# EAGLE board ENERGIS_Rack-PDU_1.0.0 (EAGLE 9.2.1), part 1 of 3
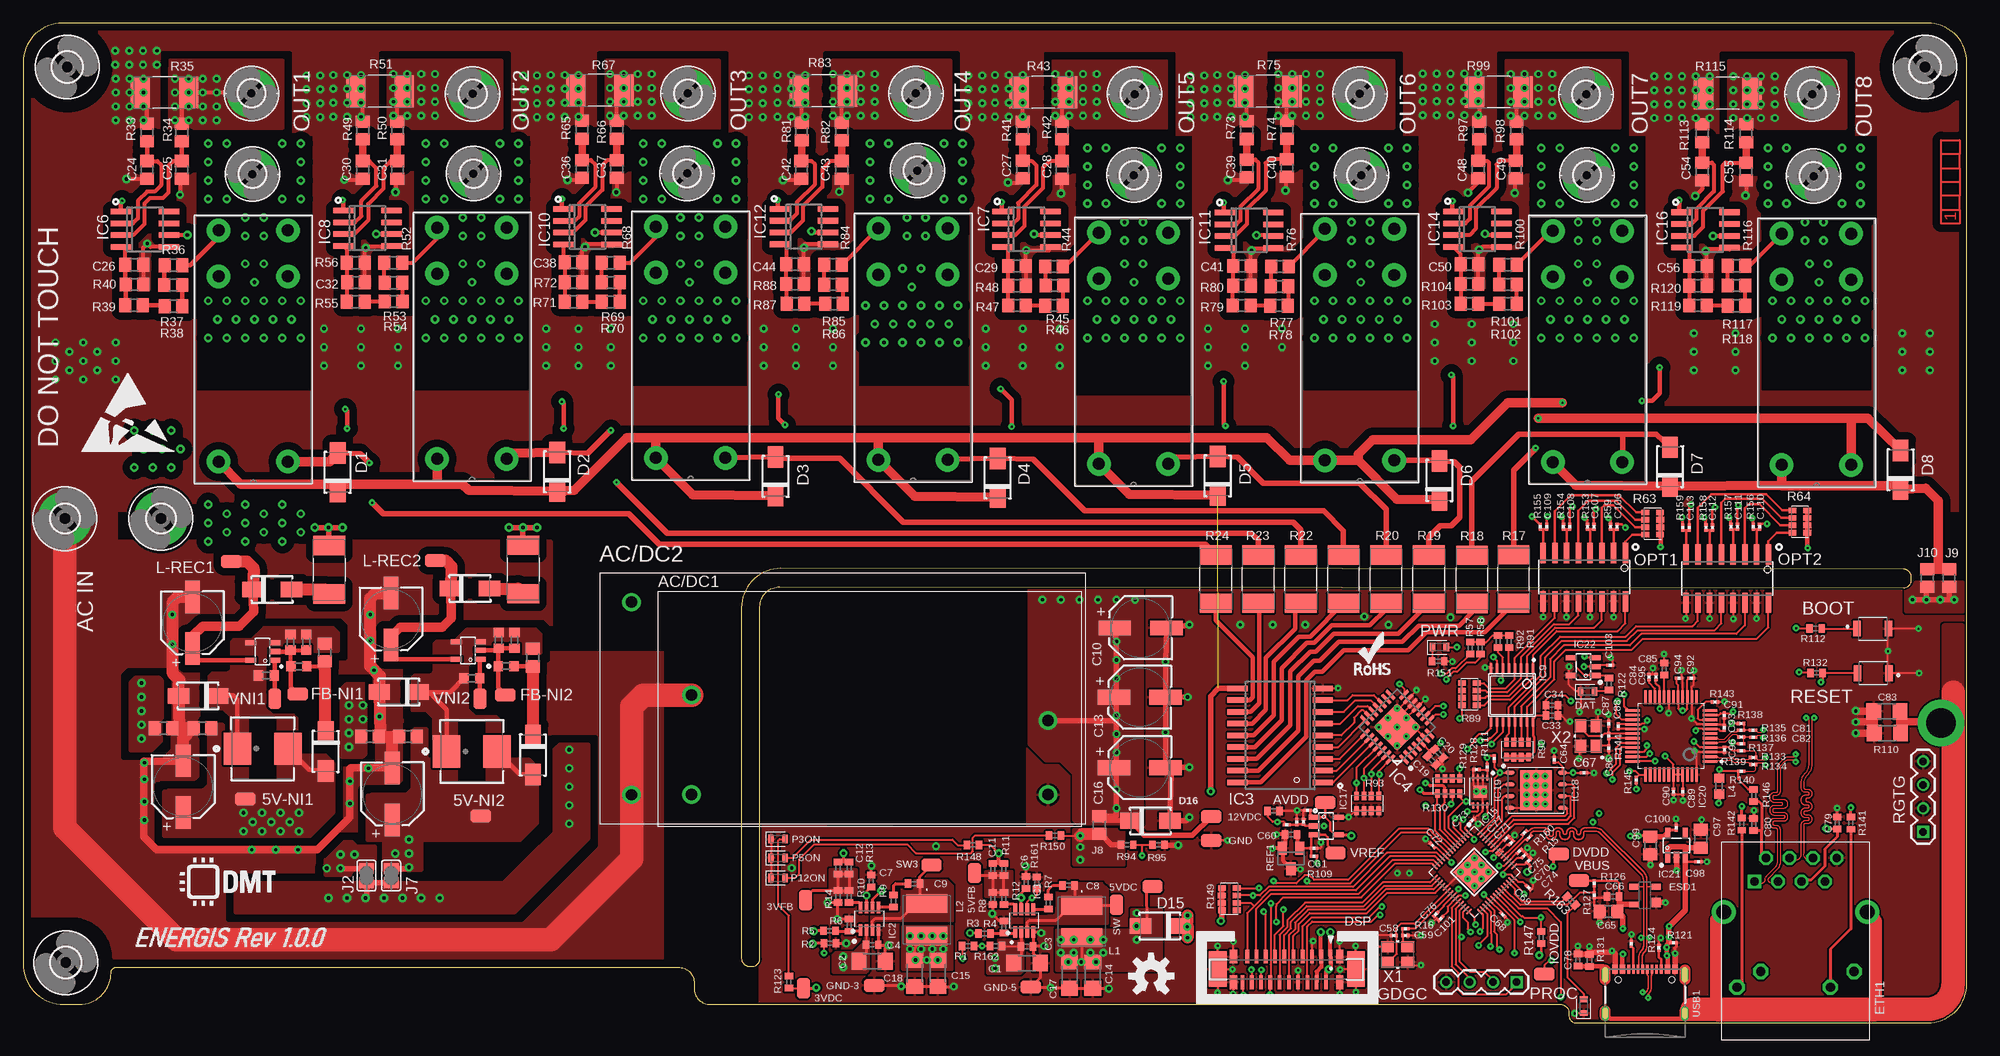
[diagram p8: board, top side]
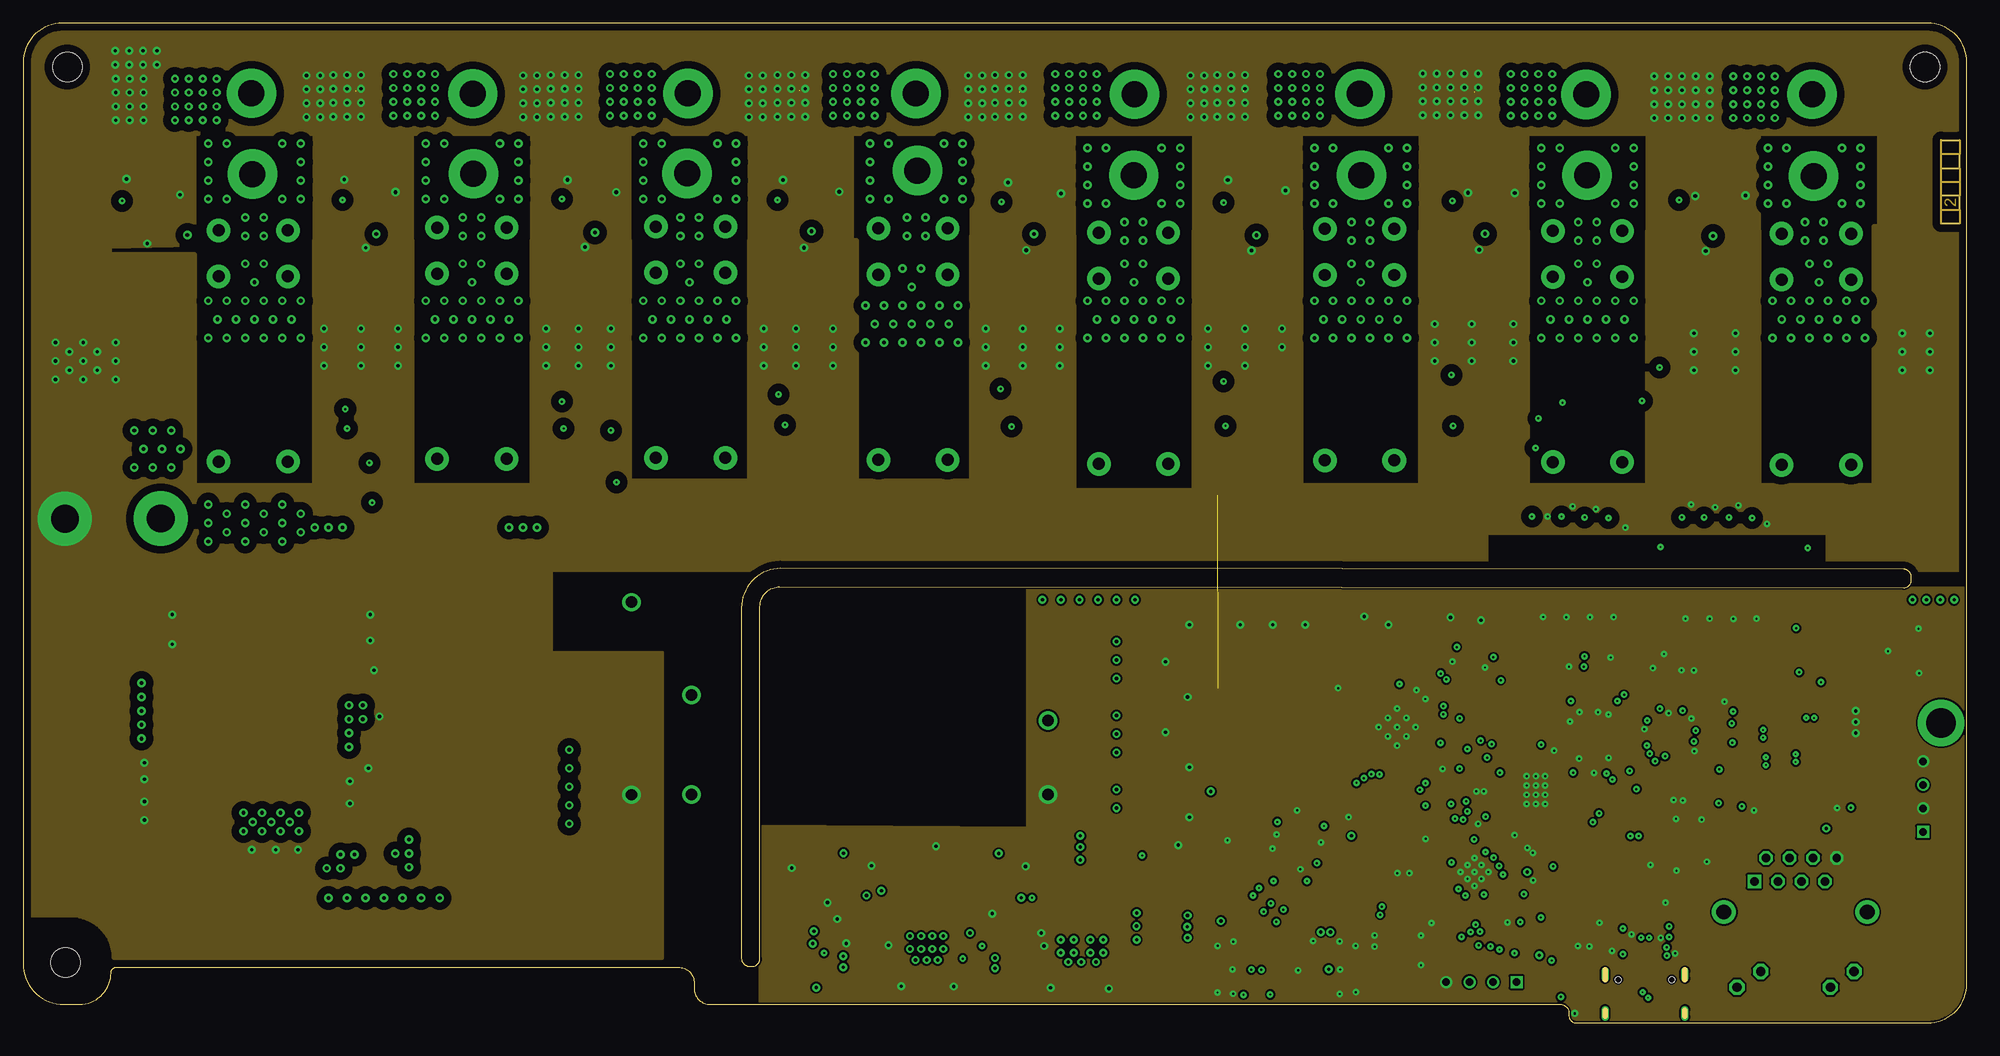
[diagram p9: board, inner layer GND/AGND]
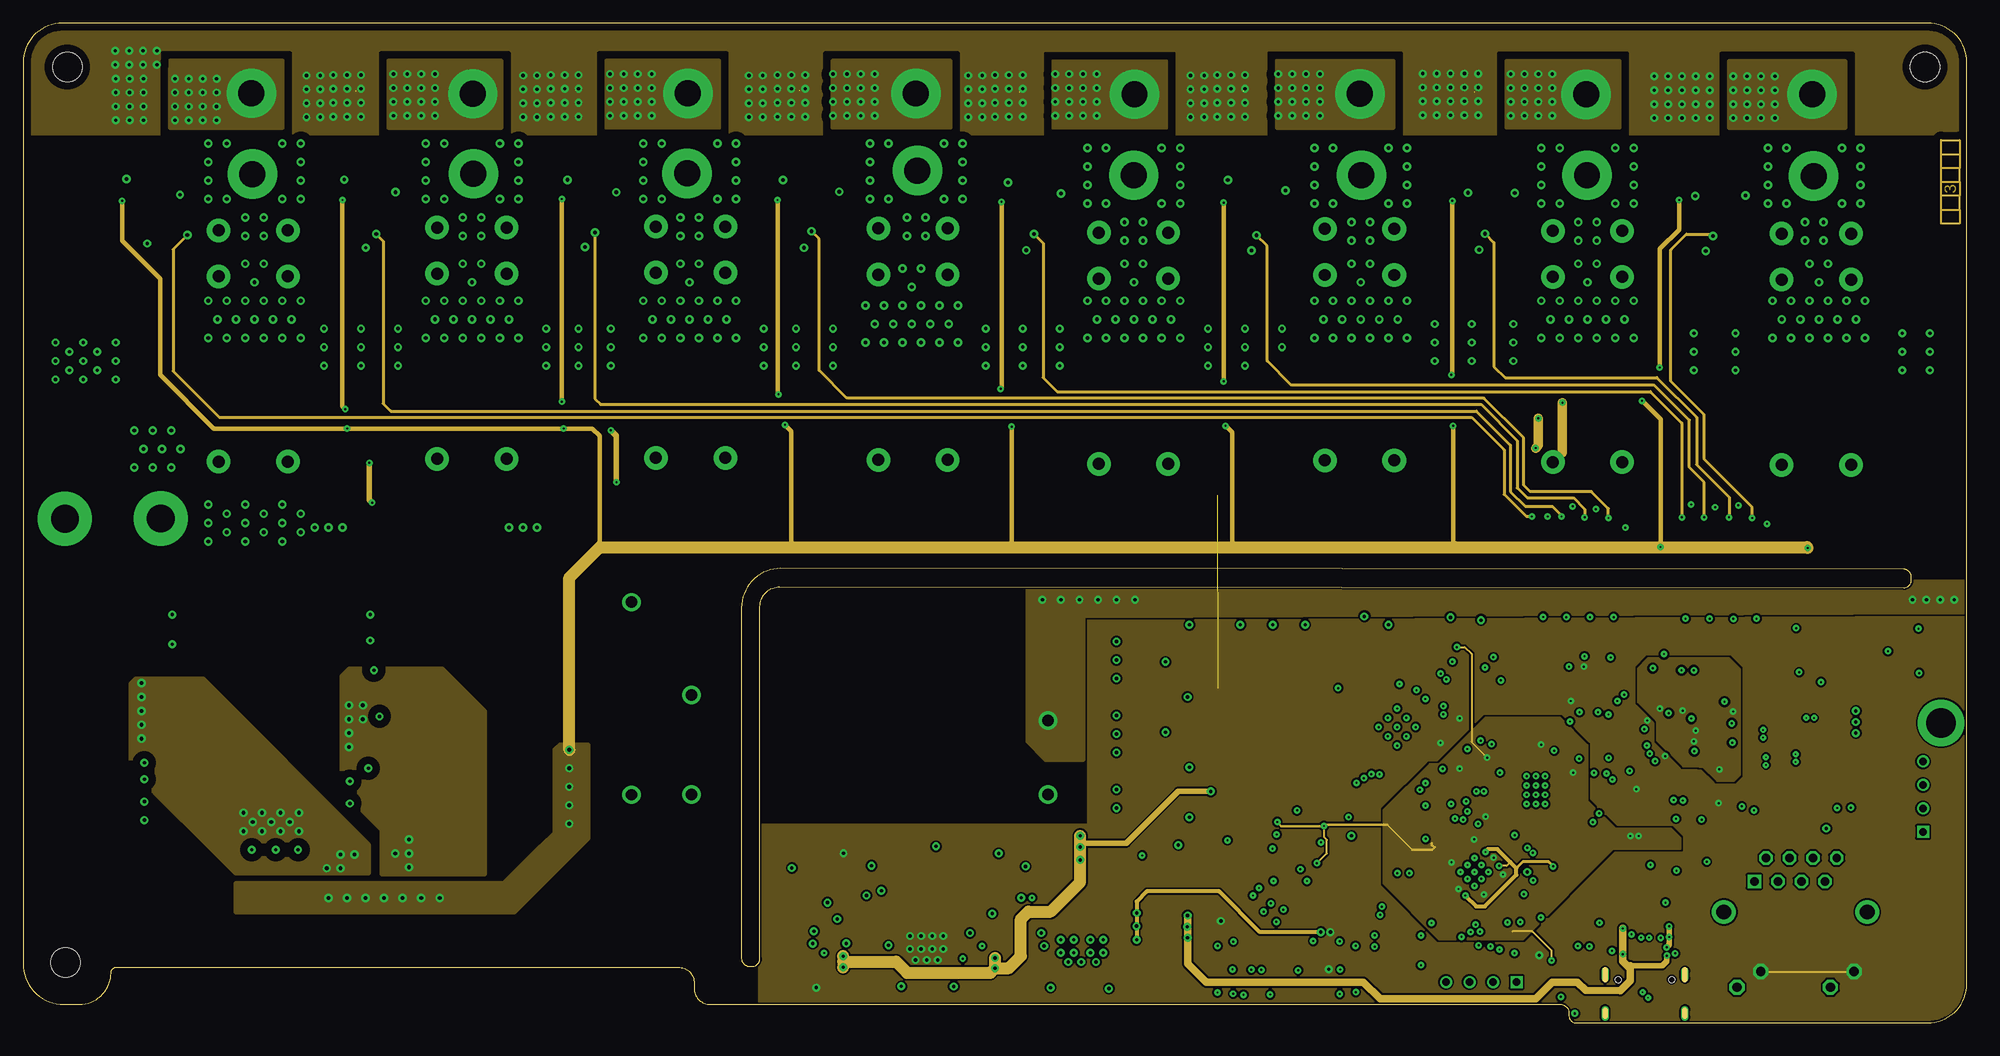
[diagram p10: board, inner layer PWR-3/SIG]
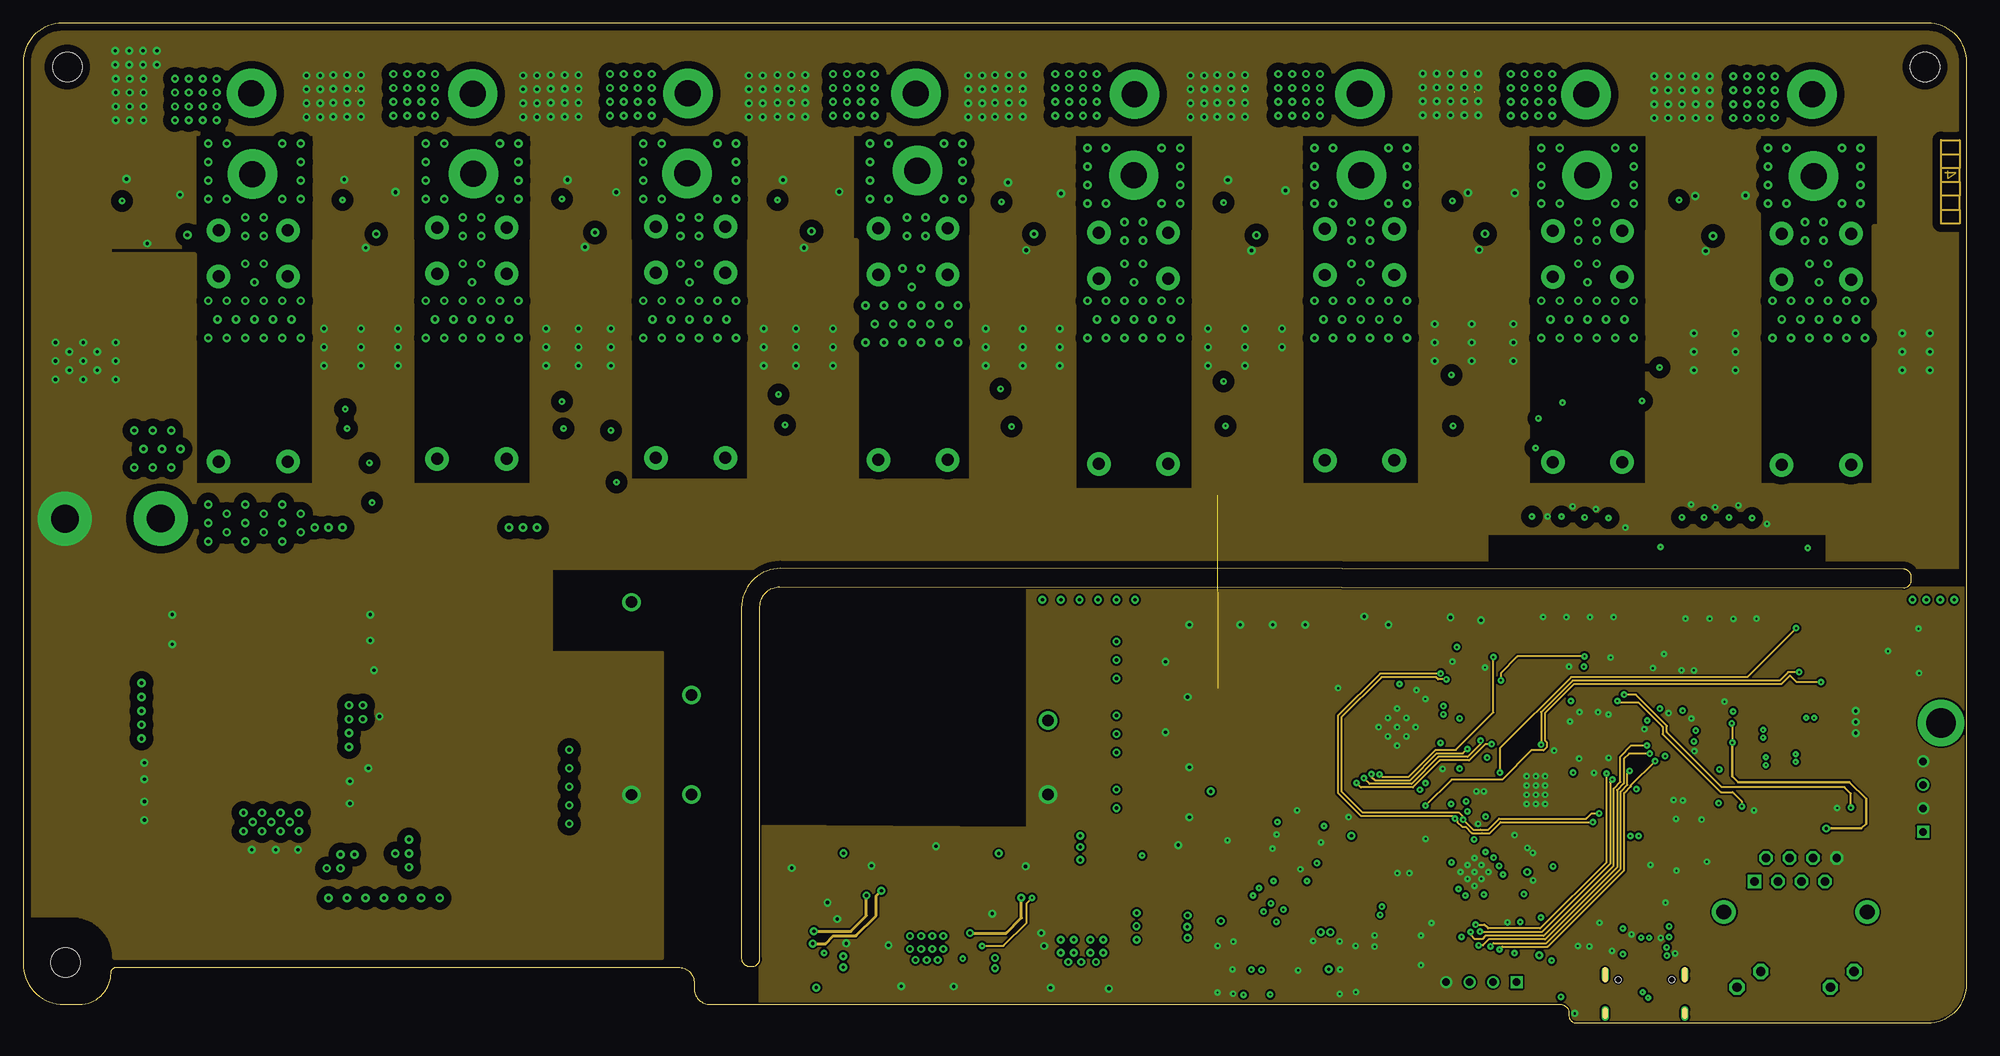
[diagram p11: board, inner layer SIG/AGND]
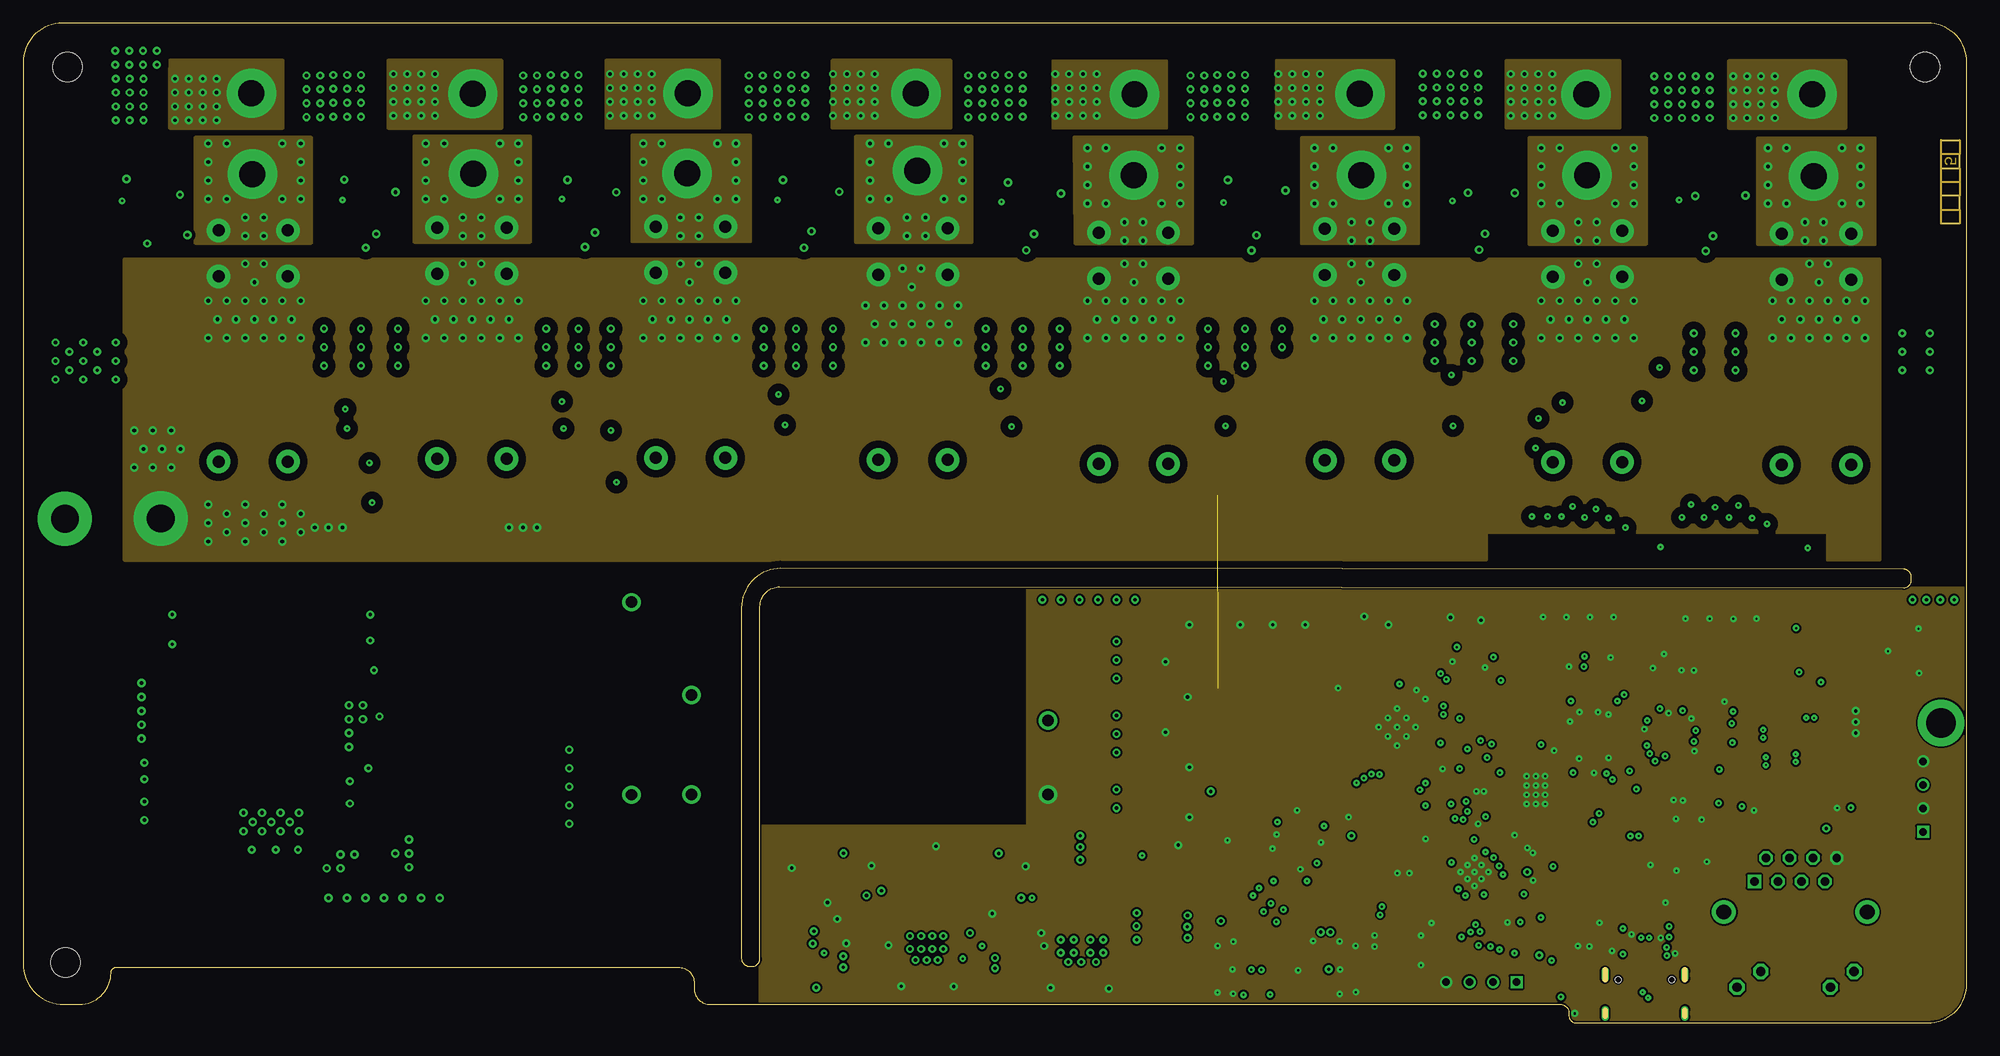
[diagram p12: board, inner layer GND-2/AC_L]
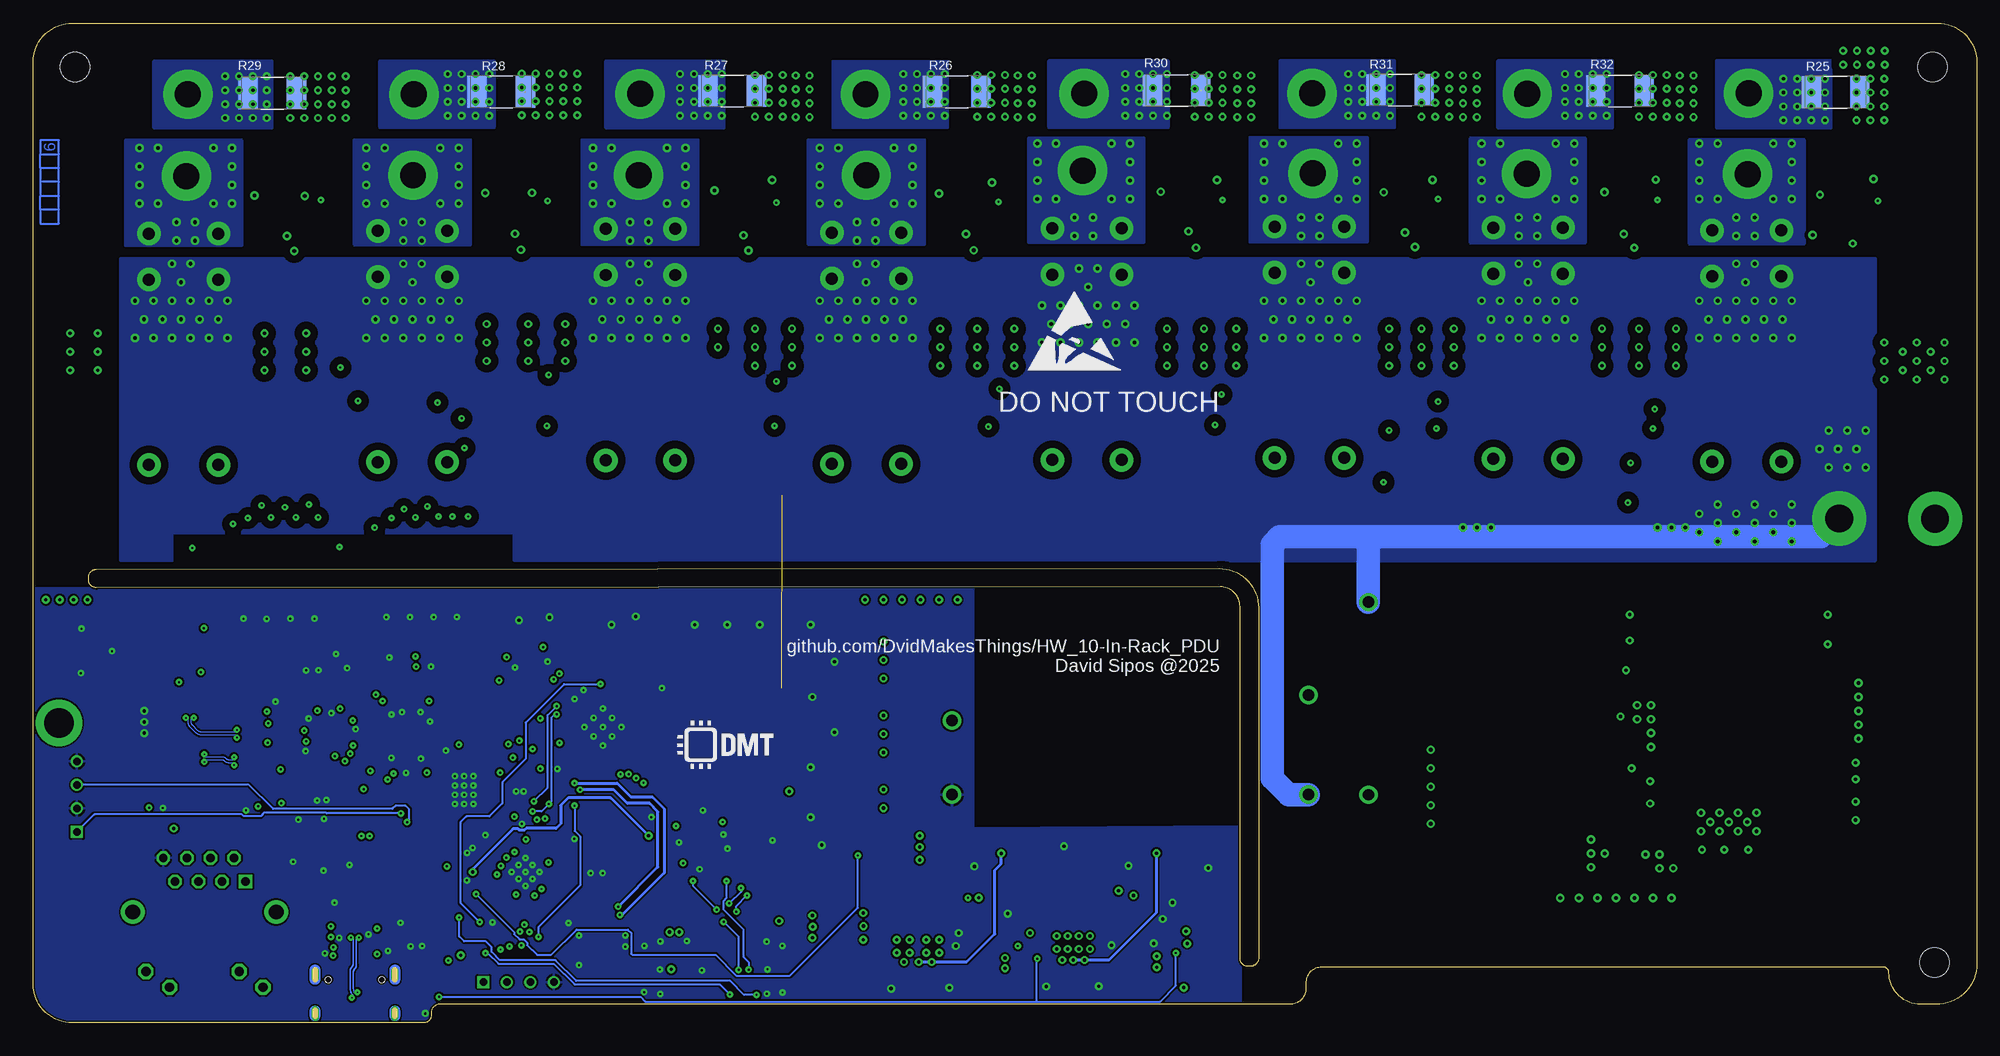
[diagram p13: board, bottom side, seen from below]

Size 210 x 108 mm. Coordinates in mm from the lower left corner, seen from the top.
Outline: 210,4.23 210,103.77 arc90 205.77,108 4.23,108 arc90 0,103.77 0,6.39 arc90 4.39,2 6.08,2 arc90 9.5,5.42 arc-90 10.08,6 70.79,6 arc-90 72.5,4.29 72.5,3.71 arc90 74.21,2 166.06,2 arc-90 167,1.06 167,0.77 arc90 167.77,0 205.77,0 arc90 210,4.23
Outline: 81.73,47.1 203.15,47 arc90 204,47.85 204,48.15 arc90 203.15,49 81.86,49.1 arc90 77.6,44.84 77.6,7 arc90 78.5,6.1 78.78,6.1 arc90 79.6,6.92 79.6,44.97 arc-90 81.73,47.1
Copper layers (1+2*3+14*15+16): SIG_HS/SIG 0.035mm / dielectric 0.0994mm / GND/AGND 0.0152mm / dielectric 0.55mm / PWR-3/SIG 0.0152mm / dielectric 0.1088mm / SIG/AGND 0.0152mm / dielectric 0.55mm / GND-2/AC_L 0.0152mm / dielectric 0.0994mm / SIG_BTM/AC_L 0.035mm
Design rules "JLC06161H-3313A_6-layer_1.6 mm-Standard": minimum track width 3.5mil, minimum drill 0.15mm, track to track 3.5mil, track to pad 3.5mil, pad to pad 3.5mil, via to via 3.5mil, smd to smd 3.5mil, copper to edge 0.2mm, drill to drill 6mil, minimum pad ring 8mil, minimum via ring 0.25mm, stop-mask expansion 0.05mm, vias tented up to drill 16mil, thermal gap 10mil
Net classes: 0 50R_SE: width 0.2 mm, drill 0.2 mm, clearance 0.178 mm; 1 100R_DIFFPAIR: width 0.121 mm, drill 0.15 mm, clearance 0.191 mm; 2 90R_DIFFPAIR: width 0.155 mm, drill 0.15 mm, clearance 0.191 mm; 3 AC_MEA: width 0.406 mm, drill 0.35 mm, clearance 0.203 mm; 4 AC_SIG: width 0.305 mm, drill 0.2 mm, clearance 0.35 mm

## Footprints (pad centres in the part's own frame; a part is rotated, then mirrored left to right if it is on the bottom)
TP = smd 2.2 x 1.4: TP 0,0
IRM_10_12 = drill 1.24: +V 19.25,0.02; -V 19.25,-7.98; AC_L -19.25,-7.98; AC_N -19.25,2.77
IRM_15_12 = drill 1.24: +V 23.47,-2.4; -V 23.47,-10.4; AC/L -21.53,10.4; AC/N -21.53,-10.4
3,0-PAD = drill 3 pad 5.842: B3,0 0,0
B3U-1000P = smd 0.8 x 1.7: 1 -1.7,0; 2 1.7,0
1206 = smd 1.6 x 1.803: 1 -1.422,0; 2 1.422,0
0402 = smd 0.7 x 0.9: 1 -0.65,0; 2 0.65,0
0603 = smd 1 x 1.1: 1 -0.85,0; 2 0.85,0
6.3X7.7(DXL) = smd 3.5 x 1.6: 1 2.8,0; 2 -2.8,0
0805 = smd 1.3 x 1.5: 1 -0.95,0; 2 0.95,0
0201 = smd 0.34 x 0.35: 1 -0.275,0; 2 0.275,0
C1206 = smd 1.6 x 1.803: 1 -1.422,0; 2 1.422,0
SMA/DO-214AC = smd 2.3 x 1.7: A 2.1,0; C -2.1,0
LED-0603 = smd 0.612 x 0.912: A 0.75,0; C -0.75,0
FPC20 = smd 0.4 x 1.5: 1 -4.552,-1.362; 2 -4.052,1.438; 3 -3.552,-1.362; 4 -3.052,1.438; 5 -2.552,-1.362; 6 -2.052,1.438; 7 -1.552,-1.362; 8 -1.052,1.438; 9 -0.552,-1.362; 10 -0.052,1.438; 11 0.448,-1.362; 12 0.948,1.438; 13 1.448,-1.362; 14 1.948,1.438; 15 2.448,-1.362; 16 2.948,1.438; 17 3.448,-1.362; 18 3.948,1.438; 19 4.448,-1.362; 20 4.948,1.438 | smd 1.93 x 3.81: Z0 -7.303,0; Z5 7.62,0 | smd 0.8 x 1.5: Z1 -5.552,-1.362; Z2 -5.552,1.438; Z3 5.948,-1.362; Z4 5.948,1.438
SOT143 = smd 1 x 1: 1 -0.75,-1.2 | smd 0.6 x 1: 2 0.95,-1.2; 3 0.95,1.2; 4 -0.95,1.2
J1B1211CCD = drill 0.9 square: 1 -4.445,6.35 | drill 0.9 octagon: 2 -3.175,8.89; 3 -1.905,6.35; 4 -0.635,8.89; 5 0.635,6.35; 6 1.905,8.89; 7 3.175,6.35; 8 4.445,8.89 | drill 1.02 octagon: 9 -6.325,-5.08; 10 -3.758,-3.38; 11 3.758,-5.08; 12 6.325,-3.38 | drill 1.6: 13 -7.75,3.05; 14 7.75,3.05
1X4 = drill 0.8 square: 1 0,3.81 | drill 0.8: 2 0,1.27; 3 0,-1.27; 4 0,-3.81
SOT65P280X110-8N = smd 1.259 x 0.4: 1 -1.228,0.975; 2 -1.228,0.325; 3 -1.228,-0.325; 4 -1.228,-0.975; 5 1.228,-0.975; 6 1.228,-0.325; 7 1.228,0.325; 8 1.228,0.975
SO18 = smd 0.6 x 2.2: 1 -5.08,-4.6; 2 -3.81,-4.6; 3 -2.54,-4.6; 4 -1.27,-4.6; 5 0,-4.6; 6 1.27,-4.6; 7 2.54,-4.6; 8 3.81,-4.6; 9 5.08,-4.6; 10 5.08,4.6; 11 3.81,4.6; 12 2.54,4.6; 13 1.27,4.6; 14 0,4.6; 15 -1.27,4.6; 16 -2.54,4.6; 17 -3.81,4.6; 18 -5.08,4.6
QFN28[6X6]ML = smd 1.27 x 0.35: 1 -2.985,1.95; 2 -2.985,1.3; 3 -2.985,0.65; 4 -2.985,0; 5 -2.985,-0.65; 6 -2.985,-1.3; 7 -2.985,-1.95; 15 2.985,-1.95; 16 2.985,-1.3; 17 2.985,-0.65; 18 2.985,0; 19 2.985,0.65; 20 2.985,1.3; 21 2.985,1.95 | smd 0.35 x 1.27: 8 -1.95,-2.985; 9 -1.3,-2.985; 10 -0.65,-2.985; 11 0,-2.985; 12 0.65,-2.985; 13 1.3,-2.985; 14 1.95,-2.985; 22 1.95,2.985; 23 1.3,2.985; 24 0.65,2.985; 25 0,2.985; 26 -0.65,2.985; 27 -1.3,2.985; 28 -1.95,2.985 | smd 3.7 x 3.7: PAD 0,0
SOT23-5 = smd 0.55 x 1.2: 1 -0.95,-1.3; 2 0,-1.3; 3 0.95,-1.3; 4 0.95,1.3; 5 -0.95,1.3
SO8 = smd 0.6 x 2.2: 1 -1.905,-2.6; 2 -0.635,-2.6; 3 0.635,-2.6; 4 1.905,-2.6; 5 1.905,2.6; 6 0.635,2.6; 7 -0.635,2.6; 8 -1.905,2.6
TSSOP16 = smd 0.305 x 0.991: 1 -2.275,-2.918; 2 -1.625,-2.918; 3 -0.975,-2.918; 4 -0.325,-2.918; 5 0.325,-2.918; 6 0.975,-2.918; 7 1.625,-2.918; 8 2.275,-2.918; 9 2.275,2.918; 10 1.625,2.918; 11 0.975,2.918; 12 0.325,2.918; 13 -0.325,2.918; 14 -0.975,2.918; 15 -1.625,2.918; 16 -2.275,2.918
QFN56 = smd 0.837 x 0.22: 1 -3.437,2.6; 2 -3.437,2.2; 3 -3.437,1.8; 4 -3.437,1.4; 5 -3.437,1; 6 -3.437,0.6; 7 -3.437,0.2; 8 -3.437,-0.2; 9 -3.437,-0.6; 10 -3.437,-1; 11 -3.437,-1.4; 12 -3.437,-1.8; 13 -3.437,-2.2; 14 -3.437,-2.6; 29 3.437,-2.6; 30 3.437,-2.2; 31 3.437,-1.8; 32 3.437,-1.4; 33 3.437,-1; 34 3.437,-0.6; 35 3.437,-0.2; 36 3.437,0.2; 37 3.437,0.6; 38 3.437,1; 39 3.437,1.4; 40 3.437,1.8; 41 3.437,2.2; 42 3.437,2.6 | smd 0.22 x 0.837: 15 -2.6,-3.437; 16 -2.2,-3.437; 17 -1.8,-3.437; 18 -1.4,-3.437; 19 -1,-3.437; 20 -0.6,-3.437; 21 -0.2,-3.437; 22 0.2,-3.437; 23 0.6,-3.437; 24 1,-3.437; 25 1.4,-3.437; 26 1.8,-3.437; 27 2.2,-3.437; 28 2.6,-3.437; 43 2.6,3.437; 44 2.2,3.437; 45 1.8,3.437; 46 1.4,3.437; 47 1,3.437; 48 0.6,3.437; 49 0.2,3.437; 50 -0.2,3.437; 51 -0.6,3.437; 52 -1,3.437; 53 -1.4,3.437; 54 -1.8,3.437; 55 -2.2,3.437; 56 -2.6,3.437 | smd 3.2 x 3.2: PAD 0,0
SON127P600X500X75-8N = smd 1.012 x 0.432: 1 -2.85,1.905; 2 -2.85,0.635; 3 -2.85,-0.635; 4 -2.85,-1.905; 5 2.85,-1.905; 6 2.85,-0.635; 7 2.85,0.635; 8 2.85,1.905 | smd 3.4 x 4.3: PAD 0,0
SON50P300X200X50-9T130X140N = smd 0.711 x 0.27: 1 -1.501,0.75; 2 -1.501,0.25; 3 -1.501,-0.25; 4 -1.501,-0.75; 5 1.501,-0.75; 6 1.501,-0.25; 7 1.501,0.25; 8 1.501,0.75 | smd 1.3 x 1.4: 9 0,0
LQFP48 = smd 1.56 x 0.28: 1 -4.18,2.75; 2 -4.18,2.25; 3 -4.18,1.75; 4 -4.18,1.25; 5 -4.18,0.75; 6 -4.18,0.25; 7 -4.18,-0.25; 8 -4.18,-0.75; 9 -4.18,-1.25; 10 -4.18,-1.75; 11 -4.18,-2.25; 12 -4.18,-2.75; 25 4.18,-2.75; 26 4.18,-2.25; 27 4.18,-1.75; 28 4.18,-1.25; 29 4.18,-0.75; 30 4.18,-0.25; 31 4.18,0.25; 32 4.18,0.75; 33 4.18,1.25; 34 4.18,1.75; 35 4.18,2.25; 36 4.18,2.75 | smd 0.28 x 1.56: 13 -2.75,-4.18; 14 -2.25,-4.18; 15 -1.75,-4.18; 16 -1.25,-4.18; 17 -0.75,-4.18; 18 -0.25,-4.18; 19 0.25,-4.18; 20 0.75,-4.18; 21 1.25,-4.18; 22 1.75,-4.18; 23 2.25,-4.18; 24 2.75,-4.18; 37 2.75,4.18; 38 2.25,4.18; 39 1.75,4.18; 40 1.25,4.18; 41 0.75,4.18; 42 0.25,4.18; 43 -0.25,4.18; 44 -0.75,4.18; 45 -1.25,4.18; 46 -1.75,4.18; 47 -2.25,4.18; 48 -2.75,4.18
SJ = smd 1.168 x 1.6: 1 -0.762,0; 2 0.762,0
RELAY_G2RL-1A-E_DC5_OMR = drill 1.295 pad 2.54: 1 -3.683,12.776; 3 -3.683,-7.239; 4 -3.683,-12.217; 5 3.81,-12.217; 6 3.81,-7.239; 8 3.81,12.776
SRR5228A = smd 4.4 x 2: 1 0,1.75; 2 0,-1.75
L-6.6X6.6 = smd 2.95 x 3.5: 1 -2.725,0; 2 2.725,0
2,8-PAD = drill 2.8 pad 5.334: B2,8 0,0
SO16 = smd 0.61 x 2.21: 1 -4.445,-2.616; 2 -3.175,-2.616; 3 -1.905,-2.616; 4 -0.635,-2.616; 5 0.635,-2.616; 6 1.905,-2.616; 7 3.175,-2.616; 8 4.445,-2.616; 9 4.445,2.616; 10 3.175,2.616; 11 1.905,2.616; 12 0.635,2.616; 13 -0.635,2.616; 14 -1.905,2.616; 15 -3.175,2.616; 16 -4.445,2.616
2512 = smd 2.08 x 3.44: 1 -2.616,0; 2 2.616,0
_0603X4-1206 = smd 0.59 x 0.92: A1 -1.2,-0.8; A2 -1.2,0.8; B1 -0.4,-0.8; B2 -0.4,0.8; C1 0.4,-0.8; C2 0.4,0.8; D1 1.2,-0.8; D2 1.2,0.8
742C083103JP = smd 0.59 x 0.92: 1 -1.2,-0.8; 2 -0.4,-0.8; 3 0.4,-0.8; 4 1.2,-0.8; 5 1.2,0.8; 6 0.4,0.8; 7 -0.4,0.8; 8 -1.2,0.8
R0201 = smd 0.34 x 0.35: 1 -0.275,0; 2 0.275,0
SOT23 = smd 1 x 1.4: 1 -0.95,-1.1; 2 0.95,-1.1; 3 0,1.1
3,2 = hole 3.2: 0,0
USB-C = smd 0.3 x 1: A5 -1.18,3.37; A6 -0.18,3.37; A7 0.32,3.37; A8 1.32,3.37; B5 1.82,3.37; B6 0.82,3.37; B7 -0.68,3.37; B8 -1.68,3.37 | smd 0.6 x 1: GND -3.155,3.37; GND2 3.295,3.37; VBUS1 -2.38,3.37; VBUS2 2.52,3.37 | drill 0.4 pad 0.6 long: SHLD1 -4.248,2.795; SHLD2 4.388,2.795; SHLD3 -4.248,-1.385; SHLD4 4.388,-1.385 | hole 0.65: -2.82,2.265; 2.96,2.265
WE-XTAL_CFPX-180 = smd 1.4 x 1.2: 1 -1.1,-0.85; 2 1.1,-0.85; 3 1.1,0.85; 4 -1.1,0.85

## Placement (x,y rotation side)
3VDC  TP  [TP]  84.29,3.72 90 top
3VFB  TP  [TP]  84.53,13.24 270 top
5V-NI1  TP  [TP]  23.99,24.18 0 top
5V-NI2  TP  [TP]  49.43,22.32 180 top
5VDC  TP  [TP]  122.01,14.72 180 top
5VFB  TP  [TP]  102.79,16.18 270 top
12VDC  TP  [TP]  128.34,22.28 0 top
AC/DC1  IRM_10_12  [IRM_10_12]  91.47,32.64 0 top
AC/DC2  IRM-10-15  [IRM_15_12]  87.27,35.04 0 top
AC_L  MOUNT-PAD-ROUND3.0  [3,0-PAD]  14.88,54.48 0 top
AC_N  MOUNT-PAD-ROUND3.0  [3,0-PAD]  4.51,54.47 0 top
AVDD  TP  [TP]  140.65,23.79 180 top
BOOT  B3U-1000P  [B3U-1000P]  199.81,42.59 0 top
C1  22uF 25V  [1206]  108.46,6.45 0 top
C2  22uF 25V  [1206]  91.73,6.64 0 top
C3  100nF 25V  [0402]  108.46,8.25 0 top
C4  100nF 25V  [0402]  91.73,8.44 0 top
C5  1nF 50V  [0603]  28.88,41.11 270 top
C6  100nF 25V  [0402]  108.36,15.15 90 top
C7  100nF 25V  [0402]  91.63,15.34 90 top
C8  100nF 25V  [0402]  112.96,14.85 0 top
C9  100nF 25V  [0402]  96.23,15.04 0 top
C10  100uF 25V  [6.3X7.7(DXL)]  120.73,42.66 180 top
C11  33pF 50V  [0402]  104.76,16.55 270 top
C12  33pF 50V  [0402]  88.03,16.74 270 top
C13  100uF 25V  [6.3X7.7(DXL)]  120.63,35.16 180 top
C14  22uF 25V  [1206]  115.56,5.15 270 top
C15  22uF 25V  [1206]  98.83,5.34 270 top
C16  100uF 25V  [6.3X7.7(DXL)]  120.63,27.56 180 top
C17  22uF 25V  [1206]  113.06,5.15 270 top
C18  22uF 25V  [1206]  96.33,5.34 270 top
C19  100nF 25V  [0402]  152.2,28.35 315 top
C20  100nF 25V  [0402]  152.95,29.09 315 top
C21  2.2uF 50V  [0603]  26.28,37.51 0 top
C22  220nF 50V  [0805]  32.58,40.01 270 top
C23  100uF 50V  [6.3X7.7(DXL)]  17.28,25.51 270 top
C24  33nF 50V  [0805]  13.38,92.16 270 top
C25  33nF 50V  [0805]  17.13,92.16 270 top
C26  33nF 50V  [0805]  12,81.9 0 top
C27  33nF 50V  [0805]  107.98,92.18 270 top
C28  33nF 50V  [0805]  112.23,92.16 270 top
C29  33nF 50V  [0805]  107.37,81.76 0 top
C30  33nF 50V  [0805]  36.68,92.16 270 top
C31  33nF 50V  [0805]  40.43,92.16 270 top
C32  33nF 50V  [0805]  35.95,79.99 0 top
C33  100nF 25V  [0402]  165.15,33.21 0 top
C34  100nF 25V  [0402]  165.15,34.31 0 top
C35  2.2uF 400V  [6.3X7.7(DXL)]  18.29,43.22 270 top
C36  33nF 50V  [0805]  60.38,92.26 270 top
C37  33nF 50V  [0805]  64.13,92.26 270 top
C38  33nF 50V  [0805]  59.47,82.16 0 top
C39  33nF 50V  [0805]  132.2,92.31 270 top
C40  33nF 50V  [0805]  136.53,92.36 270 top
C41  33nF 50V  [0805]  131.67,81.76 0 top
C42  33nF 50V  [0805]  84.08,92.16 270 top
C43  33nF 50V  [0805]  88.43,92.16 270 top
C44  33nF 50V  [0805]  83.37,81.96 0 top
C45  1uF 50V  [0805]  19.38,31.81 0 top
C46  2.2uF 50V  [0603]  48.48,37.23 0 top
C47  2.2uF 400V  [6.3X7.7(DXL)]  39.74,43.62 270 top
C48  33nF 50V  [0805]  157.2,92.17 270 top
C49  33nF 50V  [0805]  161.23,92.17 270 top
C50  33nF 50V  [0805]  156.25,81.96 0 top
C51  1nF 50V  [0603]  51.38,41.33 270 top
C52  220nF 50V  [0805]  55.05,39.44 270 top
C53  100uF 50V  [6.3X7.7(DXL)]  39.88,24.73 270 top
C54  33nF 50V  [0805]  181.39,91.97 270 top
C55  33nF 50V  [0805]  186.13,91.97 270 top
C56  33nF 50V  [0805]  180.95,81.76 0 top
C57  1uF 50V  [0805]  41.58,30.93 0 top
C58  15pF 50V  [0201]  148.06,9.44 180 top
C59  15pF 50V  [0201]  149.34,9.44 0 top
C60  1uF 25V  [0402]  136.99,20.35 180 top
C61  100nF 25V  [0201]  139.46,18.87 0 top
C62  100nF 25V  [0201]  138.76,22.96 180 top
C63  100nF 25V  [0201]  138.31,21.72 90 top
C64  100nF 25V  [0201]  165.41,28.43 90 top
C65  10uF 50V  [0805]  171.29,12.03 180 top
C66  100nF 25V  [0402]  171.78,13.65 180 top
C67  100nF 25V  [0201]  168.64,27.01 0 top
C68  100nF 25V  [0201]  159.86,11.69 315 top
C69  100nF 25V  [0201]  162.64,14.61 315 top
C70  100nF 25V  [0201]  162.15,18.03 45 top
C71  100nF 25V  [0201]  160.75,19.43 45 top
C72  100nF 25V  [0201]  152.26,19.16 135 top
C73  100nF 25V  [0201]  156.53,21.86 45 top
C74  100nF 25V  [0201]  162.66,17.53 45 top
C75  100nF 25V  [0201]  161.64,18.55 45 top
C76  100nF 25V  [0201]  153.13,11.25 225 top
C77  100nF 25V  [0201]  160.25,19.95 45 top
C78  4.7nF 50V  [0402]  167.97,6.77 90 top
C79  100nF 25V  [0402]  195.99,21.6 90 top
C80  22nF 50V  [0402]  186.96,21.43 90 top
C81  6.8nF 50V  [0201]  186.9,30.86 0 top
C82  6.8nF 50V  [0201]  186.89,31.6 0 top
C83  C1206C102KGRACTM  [C1206]  201.34,33.65 0 top
C84  100nF 25V  [0201]  175.66,37.36 90 top
C85  4.7uF 25V  [0402]  177.29,38.24 90 top
C86  18pF 50V  [0201]  171.3,29.67 270 top
C87  18pF 50V  [0201]  171.3,32.31 90 top
C88  100nF 25V  [0201]  172.32,32.03 270 top
C89  100nF 25V  [0201]  179.3,24.97 270 top
C90  100nF 25V  [0201]  178.3,24.97 270 top
C91  100nF 25V  [0201]  183.79,33.19 270 top
C92  100nF 25V  [0201]  180.2,37.22 0 top
C93  100nF 25V  [0201]  183.79,31.89 90 top
C94  100nF 25V  [0201]  178.9,37.22 0 top
C95  100nF 25V  [0201]  176.4,37.37 90 top
C96  100nF 25V  [0201]  183.8,29.49 270 top
C97  10uF 50V  [0805]  181.23,19.89 90 top
C98  100nF 25V  [0201]  181,17.4 0 top
C99  10uF 50V  [0805]  175.81,19.14 270 top
C100  100nF 25V  [0201]  178.59,21.07 90 top
C101  100nF 25V  [0201]  152.63,11.75 225 top
C102  1uF 16V  [0201]  137.6,21.7 90 top
C103  100nF 25V  [0201]  171.48,38.63 0 top
C104  1uF 25V  [0402]  135.1,22.9 0 top
C106  1nF 25V  [0201]  172.2,53.6 90 top
C107  1nF 25V  [0201]  169.7,53.6 90 top
C108  1nF 25V  [0201]  167.1,53.6 90 top
C109  1nF 25V  [0201]  164.6,53.6 90 top
C110  1nF 25V  [0201]  187.6,53.6 90 top
C111  1nF 25V  [0201]  185.2,53.6 90 top
C112  1nF 25V  [0201]  182.5,53.5 90 top
C113  1nF 25V  [0201]  180,53.5 90 top
D1  MBRA340T3G  [SMA/DO-214AC]  33.98,59.47 90 top
D2  MBRA340T3G  [SMA/DO-214AC]  57.69,59.52 90 top
D3  MBRA340T3G  [SMA/DO-214AC]  81.29,59.04 90 top
D4  MBRA340T3G  [SMA/DO-214AC]  105.28,58.87 90 top
D5  MBRA340T3G  [SMA/DO-214AC]  129.06,59.09 90 top
D6  MBRA340T3G  [SMA/DO-214AC]  153,58.59 90 top
D7  MBRA340T3G  [SMA/DO-214AC]  177.93,60.08 90 top
D8  MBRA340T3G  [SMA/DO-214AC]  202.83,59.74 90 top
D9  1N4007  [SMA/DO-214AC]  32.68,29.31 270 top
D10  1N4007  [SMA/DO-214AC]  26.9,46.8 0 top
D11  US1J-E3/61T  [SMA/DO-214AC]  18.88,35.31 180 top
D12  1N4007  [SMA/DO-214AC]  48.28,46.91 0 top
D13  1N4007  [SMA/DO-214AC]  55.08,28.93 270 top
D14  US1J-E3/61T  [SMA/DO-214AC]  40.58,35.73 180 top
D15  SS12  [SMA/DO-214AC]  122.81,10.47 180 top
D16  SMAJ15A  [SMA/DO-214AC]  121.79,21.82 0 top
DAT  Blue  [LED-0603]  169.01,35.81 0 top
DSP  AFC11-S20ICC-00  [FPC20]  136.69,5.8 180 top
DVDD  TP  [TP]  165.9,18.21 0 top
ESD1  SP0503BAHTG  [SOT143]  175.22,13.75 90 top
ETH1  J1B1211CCD  [J1B1211CCD]  191.48,8.92 0 top
FB-NI1  TP  [TP]  29.68,35.51 0 top
FB-NI2  TP  [TP]  52.08,35.43 0 top
GDGC  [1X4]  157.54,4.39 270 top
GND  TP  [TP]  128.34,19.71 180 top
GND-3  TP  [TP]  91.93,4.04 180 top
GND-5  TP  [TP]  108.86,3.85 0 top
IC1  MP2315GJ-Z  [SOT65P280X110-8N]  108.16,11.05 90 top
IC2  MP2315GJ-Z  [SOT65P280X110-8N]  91.43,11.24 90 top
IC3  ULN2803AFWG  [SO18]  135.81,31.05 90 top
IC4  MCP23017T-E/ML  [QFN28[6X6]ML]  148.45,31.95 135 top
IC5  MP150GJ  [SOT23-5]  48.08,40.23 90 top
IC6  HLW8032  [SO8]  13.16,85.72 270 top
IC7  HLW8032  [SO8]  108.4,85.73 270 top
IC8  HLW8032  [SO8]  37.2,85.84 270 top
IC9  SN74HC151PWR  [TSSOP16]  160.85,35.41 180 top
IC10  HLW8032  [SO8]  60.97,85.99 270 top
IC11  HLW8032  [SO8]  132.45,85.62 270 top
IC12  HLW8032  [SO8]  84.34,86.01 270 top
IC13  MP150GJ  [SOT23-5]  25.88,40.11 90 top
IC14  HLW8032  [SO8]  157.11,85.74 270 top
IC15  RP2040  [QFN56]  156.78,16.29 315 top
IC16  HLW8032  [SO8]  181.74,85.66 270 top
IC17  MCP6001RT-I/OT  [SOT23-5]  140.77,21.26 270 top
IC18  W25Q128JVPIQ  [SON127P600X500X75-8N]  163.45,25.13 0 top
IC19  CAT24C256HU4IGT3  [SON50P300X200X50-9T130X140N]  157.42,24.98 270 top
IC20  W5500  [LQFP48]  178.04,30.99 180 top
IC21  MIC5504-3.3YM5  [SOT23-5]  178.62,19.17 0 top
IC22  MCP6001RT-I/OT  [SOT23-5]  168.55,38.47 90 top
IOVDD  TP  [TP]  164.34,5.26 0 top
J2  JP  [SJ]  37.1,15.9 270 top
J7  JP  [SJ]  39.76,15.9 270 top
J8  0R 1%  [0805]  116.25,21.35 90 top
J9  0R 1%  [0805]  208.07,48.04 270 top
J10  0R 1%  [0805]  205.71,48.06 270 top
K1  G2RL-1A-E DC12  [RELAY_G2RL-1A-E_DC5_OMR]  24.92,73.4 180 top
K2  G2RL-1A-E DC12  [RELAY_G2RL-1A-E_DC5_OMR]  48.54,73.7 180 top
K3  G2RL-1A-E DC12  [RELAY_G2RL-1A-E_DC5_OMR]  72.17,73.8 180 top
K4  G2RL-1A-E DC12  [RELAY_G2RL-1A-E_DC5_OMR]  96.2,73.6 180 top
K5  G2RL-1A-E DC12  [RELAY_G2RL-1A-E_DC5_OMR]  120.02,73.15 180 top
K6  G2RL-1A-E DC12  [RELAY_G2RL-1A-E_DC5_OMR]  144.44,73.55 180 top
K7  G2RL-1A-E DC12  [RELAY_G2RL-1A-E_DC5_OMR]  169.07,73.35 180 top
K8  G2RL-1A-E DC12  [RELAY_G2RL-1A-E_DC5_OMR]  193.8,73.05 180 top
L1  4.9uH  [SRR5228A]  114.36,10.95 0 top
L2  4.2uH  [SRR5228A]  97.63,11.14 0 top
L3  1mH  [L-6.6X6.6]  25.88,29.61 0 top
L4  BLM18EG221TN1D  [0603]  183.23,25.58 90 top
L5  1mH  [L-6.6X6.6]  48.48,29.33 0 top
L-REC1  TP  [TP]  22.46,49.86 180 top
L-REC2  TP  [TP]  44.51,49.95 180 top
L_OUT1  MOUNT-PAD-ROUND2.8  [2,8-PAD]  24.77,91.69 90 top
L_OUT2  MOUNT-PAD-ROUND2.8  [2,8-PAD]  48.65,91.73 90 top
L_OUT3  MOUNT-PAD-ROUND2.8  [2,8-PAD]  71.73,91.77 90 top
L_OUT4  MOUNT-PAD-ROUND2.8  [2,8-PAD]  96.61,92.07 90 top
L_OUT5  MOUNT-PAD-ROUND2.8  [2,8-PAD]  119.99,91.57 90 top
L_OUT6  MOUNT-PAD-ROUND2.8  [2,8-PAD]  144.57,91.57 90 top
L_OUT7  MOUNT-PAD-ROUND2.8  [2,8-PAD]  168.95,91.57 90 top
L_OUT8  MOUNT-PAD-ROUND2.8  [2,8-PAD]  193.43,91.47 90 top
N_OUT1  MOUNT-PAD-ROUND2.8  [2,8-PAD]  24.66,100.42 90 top
N_OUT2  MOUNT-PAD-ROUND2.8  [2,8-PAD]  48.57,100.37 90 top
N_OUT3  MOUNT-PAD-ROUND2.8  [2,8-PAD]  71.81,100.41 90 top
N_OUT4  MOUNT-PAD-ROUND2.8  [2,8-PAD]  96.45,100.4 90 top
N_OUT5  MOUNT-PAD-ROUND2.8  [2,8-PAD]  120.07,100.32 90 top
N_OUT6  MOUNT-PAD-ROUND2.8  [2,8-PAD]  144.41,100.35 90 top
N_OUT7  MOUNT-PAD-ROUND2.8  [2,8-PAD]  168.86,100.3 90 top
N_OUT8  MOUNT-PAD-ROUND2.8  [2,8-PAD]  193.27,100.32 90 top
OPT1  ACPL-247-500E  [SO16]  168.65,48.15 180 top
OPT2  ACPL-247-500E  [SO16]  184.1,48 180 top
P3ON  Green  [LED-0603]  81.56,19.86 0 top
P5ON  Green  [LED-0603]  81.56,17.82 0 top
P12ON  Green  [LED-0603]  81.56,15.67 0 top
PROC  Green  [LED-0603]  168.6,1.8 90 top
PWR  Green  [LED-0603]  153,40.58 0 top
R1  DNI  [0402]  102.1,8.3 180 top
R2  10K 1%  [0402]  87.15,8.59 180 top
R3  100K 1%  [0402]  103.86,9.65 0 top
R4  9.09K 1%  [0402]  105.96,10.35 90 top
R5  100K 1%  [0402]  87.13,9.94 0 top
R6  7.5K 1%  [0402]  89.23,10.54 90 top
R7  10R 1%  [0402]  110.76,12.95 270 top
R8  20K 1%  [0402]  105.96,13.45 90 top
R9  10R 1%  [0402]  94.03,13.14 270 top
R10  33K  [0402]  89.23,13.64 90 top
R11  40.2K 1%  [0402]  105.96,16.55 270 top
R12  7.5K 1%  [0402]  104.76,13.45 270 top
R13  40.2K 1%  [0402]  89.23,16.74 270 top
R14  12.7K 1%  [0402]  88.03,13.64 270 top
R15  27R 1%  [0201]  162.69,20.02 225 top
R16  1K 1%  [0201]  149.34,10.17 0 top
R17  330R 1% 1W  [2512]  161.01,47.96 90 top
R18  330R 1% 1W  [2512]  156.52,47.91 90 top
R19  330R 1% 1W  [2512]  151.84,47.93 90 top
R20  330R 1% 1W  [2512]  147.24,47.93 90 top
R21  330R 1% 1W  [2512]  142.64,47.93 90 top
R22  330R 1% 1W  [2512]  138.04,47.93 90 top
R23  330R 1% 1W  [2512]  133.44,47.93 90 top
R24  330R 1% 1W  [2512]  128.84,47.93 90 top
R25  0.002R 1%  [2512]  15.26,100.54 0 bottom
R26  0.002R 1%  [2512]  110.21,100.57 0 bottom
R27  0.002R 1%  [2512]  134.46,100.67 0 bottom
R28  0.002R 1%  [2512]  159.42,100.59 0 bottom
R29  0.002R 1%  [2512]  184.16,100.44 0 bottom
R30  0.002R 1%  [2512]  86.46,100.72 0 bottom
R31  0.002R 1%  [2512]  62.31,100.77 0 bottom
R32  0.002R 1%  [2512]  38.56,100.67 0 bottom
R33  1K 1%  [0805]  13.38,96.18 270 top
R34  1K 1%  [0805]  17.14,96.18 270 top
R35  0.002R 1%  [2512]  15.27,100.51 180 top
R36  470K 1%  [0805]  16.25,81.84 0 top
R37  470K 1%  [0805]  16.22,79.71 180 top
R38  470K 1%  [0805]  16.23,77.4 180 top
R39  470K 1%  [0805]  12,77.52 180 top
R40  1K 1%  [0805]  12.03,79.77 0 top
R41  1K 1%  [0805]  107.98,96.4 270 top
R42  1K 1%  [0805]  112.24,96.38 270 top
R43  0.002R 1%  [2512]  110.21,100.54 180 top
R44  470K 1%  [0805]  111.38,81.7 180 top
R45  470K 1%  [0805]  111.42,79.66 180 top
R46  470K 1%  [0805]  111.38,77.48 180 top
R47  470K 1%  [0805]  107.36,77.5 180 top
R48  1K 1%  [0805]  107.38,79.62 0 top
R49  1K 1%  [0805]  36.68,96.38 270 top
R50  1K 1%  [0805]  40.44,96.38 270 top
R51  0.002R 1%  [2512]  38.56,100.64 180 top
R52  470K 1%  [0805]  39.98,82.1 180 top
R53  470K 1%  [0805]  40.02,79.96 180 top
R54  470K 1%  [0805]  40.03,77.93 180 top
R55  470K 1%  [0805]  35.94,77.9 180 top
R56  1K 1%  [0805]  35.94,82.12 0 top
R57  0R 1%  [0402]  156.33,40.49 270 top
R58  DNI  [0402]  157.43,40.49 270 top
R59  1K 1%  [0201]  171.5,53.6 270 top
R60  4.99K 1%  [0603]  30.58,41.11 90 top
R61  4.99K 1%  [0603]  29.78,38.51 180 top
R62  39R 1% 2W  [2512]  33.07,48.95 270 top
R63  1K 1%  [_0603X4-1206]  176.05,53.95 90 top
R64  1K 1%  [_0603X4-1206]  191.95,54.15 90 top
R65  1K 1%  [0805]  60.38,96.48 270 top
R66  1K 1%  [0805]  64.14,96.48 270 top
R67  0.002R 1%  [2512]  62.31,100.74 180 top
R68  470K 1%  [0805]  63.48,82.1 180 top
R69  470K 1%  [0805]  63.49,79.99 180 top
R70  470K 1%  [0805]  63.48,77.88 180 top
R71  470K 1%  [0805]  59.46,77.9 180 top
R72  1K 1%  [0805]  59.48,80.02 0 top
R73  1K 1%  [0805]  132.2,96.43 270 top
R74  1K 1%  [0805]  136.54,96.48 270 top
R75  0.002R 1%  [2512]  134.46,100.64 180 top
R76  470K 1%  [0805]  135.78,81.7 180 top
R77  470K 1%  [0805]  135.72,79.56 180 top
R78  470K 1%  [0805]  135.68,77.48 180 top
R79  470K 1%  [0805]  131.66,77.5 180 top
R80  1K 1%  [0805]  131.68,79.62 0 top
R81  1K 1%  [0805]  84.1,96.27 270 top
R82  1K 1%  [0805]  88.44,96.28 270 top
R83  0.002R 1%  [2512]  86.46,100.69 180 top
R84  470K 1%  [0805]  87.48,81.9 180 top
R85  470K 1%  [0805]  87.52,79.76 180 top
R86  470K 1%  [0805]  87.58,77.68 180 top
R87  470K 1%  [0805]  83.46,77.7 180 top
R88  1K 1%  [0805]  83.38,79.82 0 top
R89  10K 1%  [_0603X4-1206]  156.25,35.51 90 top
R90  10K 1%  [_0603X4-1206]  161.45,29.51 180 top
R91  0R 1%  [0402]  160.55,41.21 90 top
R92  DNI  [0402]  159.35,41.21 90 top
R93  4x10K 1206  [742C083103JP]  145.25,23.71 180 top
R94  100K 1%  [0402]  119.28,19.24 180 top
R95  10K 1%  [0402]  122.68,19.24 180 top
R96  10K 1%  [0805]  15.18,31.81 0 top
R97  1K 1%  [0805]  157.3,96.4 270 top
R98  1K 1%  [0805]  161.34,96.4 270 top
R99  0.002R 1%  [2512]  159.42,100.56 180 top
R100  470K 1%  [0805]  160.4,81.9 180 top
R101  470K 1%  [0805]  160.4,79.76 180 top
R102  470K 1%  [0805]  160.4,77.68 180 top
R103  470K 1%  [0805]  156.24,77.7 180 top
R104  1K 1%  [0805]  156.26,79.82 0 top
R105  4.99K 1%  [0603]  52.18,38.53 180 top
R106  39R 1% 2W  [2512]  54.03,48.98 270 top
R107  4.99K 1%  [0603]  53.08,41.33 90 top
R108  10K 1%  [0805]  37.48,30.93 0 top
R109  4.7K 1%  [0201]  139.46,18 0 top
R110  1M 1%  [1206]  201.4,31.3 0 top
R111  DNI  [R0201]  158.94,28.56 90 top
R112  1K 1%  [0402]  193.66,42.6 180 top
R113  1K 1%  [0805]  181.39,96.1 270 top
R114  1K 1%  [0805]  186.14,96.1 270 top
R115  0.002R 1%  [2512]  184.16,100.41 180 top
R116  470K 1%  [0805]  185.1,81.8 180 top
R117  470K 1%  [0805]  185.1,79.66 180 top
R118  470K 1%  [0805]  185.1,77.48 180 top
R119  470K 1%  [0805]  180.94,77.5 180 top
R120  1K 1%  [0805]  180.96,79.62 0 top
R121  2.2K 1%  [0201]  178.31,8.66 0 top
R122  1K 1%  [0402]  171.32,36.59 270 top
R123  1K 1%  [0402]  82.73,4.39 90 top
R124  5.1K 1%  [0201]  176.72,8.12 90 top
R125  5.1K 1%  [0201]  173.74,8.54 90 top
R126  10K 1%  [0201]  169.74,15.08 270 top
R127  10K 1%  [0201]  169.73,13.78 270 top
R128  NC  [R0201]  158.17,27.64 90 top
R129  4.7K 1%  [0201]  157.02,27.36 0 top
R130  3.3K 1%  [_0603X4-1206]  154,25.58 0 top
R131  1M 1%  [0402]  169.23,6.75 90 top
R132  10K 1%  [0402]  193.75,37.81 0 top
R133  3.3R 1%  [0201]  186.9,28.66 0 top
R134  3.3R 1%  [0201]  186.91,27.9 0 top
R135  3.3R 1%  [0201]  185.6,31.6 0 top
R136  3.3R 1%  [0201]  185.61,30.87 0 top
R137  49.9R 1%  [0201]  185.61,30.14 0 top
R138  49.9R 1%  [0201]  185.6,32.33 0 top
R139  49.9R 1%  [0201]  185.6,29.4 180 top
R140  49.9R 1%  [0201]  185.62,27.17 180 top
R141  470R 1%  [0402]  197.46,21.56 270 top
R142  470R 1%  [0402]  185.66,21.45 270 top
R143  12.4K 1%  [R0201]  182.77,34.66 180 top
R144  1M 1%  [0201]  171.3,30.98 270 top
R145  4.7K 1%  [0201]  174.26,26.23 270 top
R146  470R 1%  [0402]  186.96,24.58 90 top
R147  10K 1%  [0402]  164.01,9.21 270 top
R148  2.4K 1%  [0402]  102.62,19.22 180 top
R149  3.3K 1%  [_0603X4-1206]  130.31,13.35 270 top
R150  8.2K 1%  [0402]  111.46,20.24 180 top
R151  1K 1%  [0402]  152.88,39.06 180 top
R152  10R 1%  [0201]  136.5,21.4 0 top
R153  1K 1%  [0201]  169,53.6 270 top
R154  1K 1%  [0201]  166.4,53.6 270 top
R155  1K 1%  [0201]  163.9,53.6 270 top
R156  1K 1%  [0201]  186.9,53.6 270 top
R157  1K 1%  [0201]  184.5,53.6 270 top
R158  1K 1%  [0201]  181.8,53.5 270 top
R159  1K 1%  [0201]  179.3,53.5 270 top
R160  27R 1%  [0201]  162.19,20.52 225 top
R161  DNI  [0402]  109.5,15.1 270 top
R162  10K 1%  [0402]  105.1,8.3 0 top
R163  1K 1%  [0402]  167.26,13.17 135 top
REF1  LM4040B30FTA  [SOT23]  136.97,17.76 180 top
RESET  B3U-1000P  [B3U-1000P]  199.88,37.76 180 top
RGTG  [1X4]  205.27,24.44 180 top
SW  TP  [TP]  118.11,12.76 270 top
SW3  TP  [TP]  98.13,17.04 180 top
U$1  [ESD_10.00]  102.6,70.42 0 bottom
U$2  [ESD_10.00]  6.24,61.6 0 top
U$3  [3,2]  205.47,103.26 0 top
U$4  [3,2]  4.77,103.26 0 top
U$5  [DMT]  19.4,15.2 0 top
U$6  [3,2]  4.6,6.5 0 top
U$7  [DMT]  137.9,30 0 bottom
U$10  [OSHW-LOGO-M]  121.87,5.05 0 top
U$11  [ROHS_LOGO_0.18_IN]  143.62,37.5 0 top
USB1  USB-TYPE-C-018  [USB-C]  175.15,2.41 0 top
VBUS  TP  [TP]  168.08,15.36 180 top
VNI1  TP  [TP]  27.18,35.01 90 top
VNI2  TP  [TP]  49.38,35.03 270 top
VREF  TP  [TP]  141.78,18.33 0 top
X1  12MHz  [WE-XTAL_CFPX-180]  148.5,7.38 0 top
X2  25MHz  [WE-XTAL_CFPX-180]  169.1,30.97 90 top

## Tracks (layer width: path | path; a pad name or v marks a point on that pad's centre or on a via)
3VFB
  SIG_HS/SIG 0.305: R14.1 C12.2 R13.2 R10.2 R14.1 | R14.1 85.26,14.29 84.53,13.56 3VFB.TP
  pour SIG_HS/SIG (isolate 0.254, rank 4, no thermals): 87.2,16.6 90,16.6 90,13.8 87.2,13.8
5V_EN  (via drill 0.2)
  SIG_HS/SIG 0.2: R1.1 v103.6,8.3 R162.1 | R161.2 109.5,13.8 109.2,13.5 v109,13.5 108.9,13.5 108.48,13.08 IC1.6
  SIG/AGND 0.2: v103.6,8.3 105.9,8.3 108.4,10.8 108.4,12.9 v109,13.5
5VFB
  SIG_HS/SIG 0.305: 104.76,15.8 C11.2 103.07,15.9 5VFB.TP | 104.76,15.8 R12.1 R8.2 R11.2 104.86,15.9 104.76,15.8
  pour SIG_HS/SIG (isolate 0.254, rank 4, no thermals): 104,16.4 106.8,16.4 106.8,13.6 104,13.6
12VRAW  (via drill 0.35)
  SIG_HS/SIG 0.61: 118.12,32.6 118.12,22.42 118,22.3 J8.2 116.67,21.89 D16.C 121.14,20.27 126.33,20.27 12VDC.TP | 118.12,32.6 v118.12,41.2 118.1,41.22 117.93,42.56 | AC/DC2.+V 118.08,32.64 118.12,32.6 | v204.12,45.7 v205.62,45.7 | v205.62,45.7 v207.12,45.7 208,45.7 | 208,45.7 v208.62,45.7 | J9.2 208.07,45.77 208,45.7 | J10.2 205.62,47.01 v205.62,45.7
  other vias: 118.12,39.2 118.12,37.2 118.12,33.2 118.12,31.2 118.12,29.2 118.12,25.2 118.12,23.2 110.12,45.7 112.12,45.7 114.12,45.7 116.12,45.7 118.12,45.7 120.12,45.7
  pour SIG_HS/SIG (isolate 0.254, rank 4, no thermals): 113.6,22 113.6,27 112.2,28.4 110.6,28.4 108.8,30.2 108.8,47 120.8,47 120.8,21.6 114,21.6
  pour PWR-3/SIG (isolate 0.254, rank 4, no thermals): 108.6,47 203.8,47 204.4,47.6 209.6,47.6 209.6,44.4 114.5,44 114.5,28.5 110.5,28.5 108.6,30.4
  pour SIG_HS/SIG (isolate 0.254, rank 4, no thermals): 203.5,47 203.5,44.5 209.5,44.5 209.5,47.5 204.5,47.5 204,47
!ACT  (via drill 0.2)
  SIG_HS/SIG 0.203: IC20.27 172.71,32.75 172.05,33.4 172.05,34.58 v172.23,34.76
  SIG_HS/SIG 0.305: R142.1 185.66,23.36 v185.68,23.38
  SIG/AGND 0.2: v172.23,34.76 172.38,34.61 174.49,34.61 177.13,31.97 177.13,31.18 183.4,24.91 184.69,24.91 185.68,23.92 v185.68,23.38
!LINK  (via drill 0.2)
  SIG_HS/SIG 0.203: IC20.25 173.38,33.75 172.96,34.17 v172.96,35.45
  SIG_HS/SIG 0.305: R141.1 v197.46,23.25
  SIG/AGND 0.2: v197.46,23.25 197.46,24.77 196.76,25.47 183.52,25.47 177.59,31.4 177.59,32.08 174.22,35.45 v172.96,35.45
!QSPI_SS  (via drill 0.2)
  SIG_HS/SIG 0.2: IC15.56 158.98,22.16 158.98,26.43 159.56,27.01 | 159.58,27.03 IC18.1
  SIG_HS/SIG 0.203: R112.2 191.58,42.6 v191.55,42.63 | R111.1 158.94,27.63 v159.54,27.03 | v159.54,27.03 159.56,27.01 | v159.54,27.03 159.58,27.03
  SIG/AGND 0.203: v191.55,42.63 186.26,37.34 167.23,37.34 159.54,29.65 v159.54,27.03
!TX_OUT  (via drill 0.2)
  SIG_HS/SIG 0.203: R92.1 159.35,40 159.87,39.48 IC9.6 159.87,37.23 v159.64,37 | IC22.3 168.85,39.42 v168.68,39.59
  SIG/AGND 0.203: v168.68,39.59 161.44,39.59 159.64,37.79 v159.64,37
!W5500_CS  (via drill 0.2)
  SIG_HS/SIG 0.203: v156.92,10.61 156.76,10.77 156.76,11.44 IC15.28 | v171.06,26.94 172.09,27.97 172.09,29.72 172.62,30.25 IC20.32
  SIG/AGND 0.203: v156.92,10.61 157.85,10.61 158.27,10.19 163.88,10.19 171.06,17.37 v171.06,26.94
!W5500_INT  (via drill 0.2)
  SIG_HS/SIG 0.203: IC15.32 158.91,12.18 158.91,9.86 159.21,9.55 159.21,8.21 v159.5,7.92 | v176.31,28.27 176.28,28.25 IC20.36
  SIG/AGND 0.203: v159.5,7.92 159.81,8.22 164.71,8.22 172.97,16.48 172.97,24.82 173.69,25.55 173.69,25.65 v176.31,28.27
!W5500_RST  (via drill 0.2)
  SIG_HS/SIG 0.2: R145.1 174.58,26.82 IC20.37
  SIG_HS/SIG 0.203: IC15.31 158.53,11.99 158.53,9.7 158.62,9.61 158.62,8.27 v158.53,8.27 | v173.56,27.22 174.17,27.22 174.58,26.82
  SIG/AGND 0.203: v158.53,8.27 158.88,8.62 164.56,8.62 172.58,16.64 172.58,24.98 173.31,25.7 173.31,26.97 v173.56,27.22
+1V1  (via drill 0.2, 0.2 pad 0.35)
  SIG_HS/SIG 0.2: IC15.45 161.39,18.35 C75.1
  SIG_HS/SIG 0.203: C77.1 159.97,19.76 IC15.50 159.05,18.86 158.73,18.54 158.06,18.54 v157.98,18.46 | C76.1 153.9,12.02 153.9,12.56 IC15.23 155.1,13.76 155.44,13.76 155.44,13.75 v155.8,13.75 | v159.47,16.96 160,16.96 IC15.45 | IC15.45 160.72,17.68 | IC15.45
  SIG_HS/SIG 0.305: DVDD.TP 165.3,17.61 v165.3,16.9
  PWR-3/SIG 0.203: 160.67,17.37 160.26,16.96 v159.47,16.96
  PWR-3/SIG 0.305: v165.3,16.9 164.8,17.4 162,17.4 161.32,16.72
  PWR-3/SIG 0.406: v155.8,13.75 156.98,12.57 157.92,12.57 161.33,15.98 161.33,16.71 161.32,16.72 160.67,17.37 159.28,18.76 158.28,18.76 v157.98,18.46
+3V3  (via drill 0.2, 0.35)
  SIG_HS/SIG 0.2: IC20.43 IC20.44 IC20.45 C89.1 | IC20.43 178.29,25.26 C90.1 | IC20.43 178.29,27.91 v177.39,28.81 | v175.46,32.66 175.15,32.35 174.89,32.35 174.79,32.25 IC20.28 172.38,32.25 C88.1 | R89.D2 155.45,36.01 | R89.C2 155.45,35.04 | R89.B2 155.45,34.29 | R145.2 174.26,25.28 v174.29,25.25
  SIG_HS/SIG 0.203: C19.1 152.12,29.19 | 152.12,29.19 C20.1 153.12,30.19 v153.12,30.24 | IC4.5 152.12,29.2 152.12,29.19 | IC9.16 163.12,32.79 163.54,33.21 C33.1 C34.1 164.5,34.84 165,35.34 166.63,35.34 v167.21,34.77 | 155.45,36.01 155.45,35.04 155.45,34.29 155.45,34.1 155.45,33.14 v155.2,32.89 | C103.1 170.01,38.63 IC22.2 v168.6,38.47 | R123.1 84.27,3.74 3VDC.TP
  SIG_HS/SIG 0.254: IC9.16 163.12,30.99 163.25,30.87 163.25,29.31 R90.A2 | R147.2 164.01,7.51 v163.8,7.3 | R89.A2 155.45,34.1
  SIG_HS/SIG 0.305: L4.1 183.23,23.78 v183.18,23.73 | C12.1 88.63,17.39 | 88.63,17.39 R13.1 | L2.2 96.33,8.09 C18.1 97.63,6.76 | 88.63,17.39 v88.63,18.33 | 97.63,6.76 C15.1 | v97.61,6.78 97.63,6.76 | 3VDC.TP 85.6,3.72 v85.69,3.8
  SIG_HS/SIG 0.406: DSP.2 140.74,5.52 141.01,5.79 | 141.01,5.79 141.24,6.02 DSP.1 141.23,7.18 v141.23,9.8 | 141.01,5.79 v141.05,5.79
  SIG_HS/SIG 0.61: R149.A1 R149.B1 R149.C1 R149.D1 129.51,11.11 v129.4,11 | R90.D2 R90.C2 R90.B2 R90.A2
  PWR-3/SIG 0.2: ETH1.10 ETH1.12
  SIG_BTM/AC_L 0.305: v88.63,18.33 88.63,11.91 93.76,6.78 v97.61,6.78
  other vias: 95.81,7.98 97.01,7.98 98.21,7.98 99.41,7.98 96.41,6.78 98.81,6.78 95.81,9.38 97.01,9.38 98.21,9.38 99.41,9.38
  pour PWR-3/SIG (isolate 0.203, rank 6, no thermals): 79.48,21.42 79.48,-0.5 212,-0.5 212,47 115,47 115,21.42
  pour SIG_HS/SIG (isolate 0.305, rank 4, no thermals): 95,10.4 95,5.8 100.4,5.8 100.4,10.4
+3V3_A  (via drill 0.2, 0.2 pad 0.35)
  SIG_HS/SIG 0.2: R139.2 184.63,29.4 184.26,29.77 C96.1 183.77,29.75 IC20.4 181.16,29.75 v180.49,30.41 | C93.1 183.76,31.58 183.28,31.58 183.12,31.75 IC20.8 180.88,31.75 v180.7,31.56 | IC20.11 183.16,33.25 183.38,33.47 C91.1 184.57,33.47 v184.74,33.63 | C92.1 179.79,37.08 IC20.15 179.79,33.92 179.6,33.73 v179.28,33.73 179.01,33.73 178.79,33.95 IC20.17 178.79,36.47 178.65,36.61 178.65,37.19 C94.1 | C95.1 176.4,36.63 176.79,36.24 IC20.21 176.79,33.97 v176.82,33.94 | L4.2 183.25,26.45 v183.25,27.37 | v183.25,27.37 v183.25,27.38 | R140.2 185.3,27.17 183.45,27.17 v183.25,27.37
  SIG_HS/SIG 0.254: R146.2 186.37,25.23 185.3,26.3 185.3,27.17
  pour PWR-3/SIG (isolate 0.254): 174.42,34.67 176.48,32.61 176.48,30.55 179.33,27.7 181.07,27.69 181.46,27.69 183,26.15 184.85,26.15 185.52,26.82 185.52,38.18 184.34,39.36 175.54,39.36 174.42,38.24
+3V3_MCU  (via drill 0.2, 0.2 pad 0.35)
  SIG_HS/SIG 0.2: IC15.49 159.46,18.46 | 159.46,18.46 159.49,18.44 IC15.48 159.46,18.46 | 159.46,18.46 | IC15.44 161.43,17.83 161.56,17.83 161.57,17.84 C70.1 | IC15.42 160.72,16.02 v159.87,16.02 | C64.1 165.86,28.15 166.3,27.71 IC18.8 v167.46,27.03 168.34,27.03 C67.1 | v158,22.28 158.16,22.45 IC19.8 | R128.2 v158.17,28.64 v158.16,28.65 | R130.A2 R130.B2 R130.C2 R130.D2 v155.2,27.45 v155.19,27.46 | C104.1 134.45,22.28 134.99,21.7 v135.5,21.7 136.22,21.7 R152.1
  SIG_HS/SIG 0.203: C73.1 155.82,21.15 155.82,20.92 IC15.1 156.76,19.98 v156.76,19.83 | C72.1 152.69,18.96 IC15.10 v154.31,17.34 v154.31,17.33 | IC15.42 161.51,15.23 162.01,15.23 C69.1 | C68.1 159.67,11.99 IC15.33 157.81,13.84 v157.81,13.86 | v155.07,14.45 155.07,14.3 IC15.22 153.5,12.73 153.5,12.62 C101.1 | IC15.44 159.87,16.27 v159.87,16.02 | v165.13,6.73 165.08,6.78 164.91,6.78 164.34,6.21 IOVDD.TP | R132.1 191.95,37.81 v191.88,37.88 | PWR.A v154.88,40.58 v154.89,40.59
  SIG_HS/SIG 0.254: C71.1 160.29,19.24 159.49,18.44 158.89,17.84 v158.87,17.84 | v140.54,21.26 | R109.2 139.73,17.28 v139.77,17.24 | R111.2 158.34,28.84 v158.16,28.65
  SIG_HS/SIG 0.305: C100.1 178,20.79 IC21.5 | C99.1 175.71,20.19 v174.54,20.19 v173.64,20.19
  SIG_HS/SIG 0.61: IC21.5 177.3,20.09 C99.1
  PWR-3/SIG 0.203: v165.13,6.73 165.13,7.78 163.02,9.89 160.91,9.89 | v154.89,40.59 155.74,40.59 156.48,39.85 156.48,30.33 v158.16,28.65 | v140.54,21.26 140.54,20.07 140.85,19.76 140.85,18.32 v139.77,17.24
  PWR-3/SIG 0.254: 152.16,19.31 152.48,18.99 152.21,18.72 150.05,18.72 147.37,21.4 140.68,21.4 v140.54,21.26 135.94,21.26 v135.5,21.7 | 152.16,19.31 152.16,19.39 | 152.16,19.31 152.16,19.2 152.45,18.91
  SIG/AGND 0.203: v191.88,37.88 190.69,37.88 189.77,36.96 167.39,36.96 164,33.57 v164,30.05
  pour PWR-3/SIG (isolate 0.203, rank 5, no thermals): 147,15 147,23 152,28 153,28 158,33 166,33 169,30 169,24 172,21 178,21 179,20 179,18.73 171.73,18.73 162,9 153,9
+5V  (via drill 0.35)
  SIG_HS/SIG 0.203: R148.1 104.48,19.22 v105.4,18.3
  SIG_HS/SIG 0.305: C17.1 v114.3,6.57 | v114.3,6.57 C14.1 | L1.2 114.36,6.63 v114.3,6.57 | 105.4,17.2 v105.4,18.3 105.3,18.2 105.3,17.2 | 105.4,17.2 | 105.4,17.2 R11.1 105.3,17.2 | 105.3,17.2 C11.1 | 121.46,10.36 121.39,14.72 5VDC.TP
  SIG_HS/SIG 0.406: DSP.4 139.74,5.54 140.24,6.04 DSP.3 140.2,7.2 v140.2,9.8
  PWR-3/SIG 0.406: v140.2,9.8 133.6,9.8 129.2,14.2 121.4,14.2 120.3,13.1 v120.3,8.97
  SIG_BTM/AC_L 0.305: v114.3,6.57 109.13,6.57 106.1,9.6 106.1,16.5 105.4,17.2 v105.4,18.3
  other vias: 112.9,6.57 115.9,6.57 113.5,7.57 112.1,7.57 115.3,7.57 116.7,7.57 112.1,8.97 113.5,8.97 115.3,8.97 116.7,8.97 120.31,11.86 120.28,10.45
  pour SIG_HS/SIG (isolate 0.305, rank 4, no thermals): 111.6,10 111.6,5.7 123,5.7 123,12.2 119.7,12.2 119.7,10
+5V_MEA  (via drill 0.2, 0.4)
  SIG_HS/SIG 0.254: R63.D1 R63.C1 R63.B1 R63.A1 | R64.D1 R64.C1 R64.B1 R64.A1
  SIG_HS/SIG 0.508: R63.D1 176.9,55.1 v176.9,51.4 | R64.D1 192.75,51.35 v192.8,51.3 | IC6.1 10.56,88.66 v10.7,88.8 | IC8.1 34.6,88.8 v34.5,88.9 | IC10.1 58.2,88.07 v58.2,89 | IC12.1 81.5,88.16 v81.5,88.9 | IC7.1 105.7,87.74 v105.7,88.7 | IC11.1 129.7,87.68 v129.7,88.6 | IC14.1 154.4,87.75 v154.4,88.8 | IC16.1 178.9,87.8 v178.9,88.9 | v34.8,66.3 35,66.1 v35,64.2 | v58.2,67.1 58.4,66.9 v58.4,64.2 | v81.6,67.9 81.6,65.3 v82.3,64.6 | v105.6,68.5 106.8,67.3 v106.8,64.4 | v129.7,69.3 129.7,64.7 v129.9,64.5 | v154.3,70 154.5,69.8 v154.5,64.5 | v176.8,70.8 176.8,68 176,67.2 v174.9,67.2
  SIG_HS/SIG 0.61: J7.2 J2.2 37.1,13.6 v37,13.5
  PWR-3/SIG 0.508: v10.7,88.8 10.7,84.5 14.8,80.4 14.8,70 20.6,64.2 v35,64.2 v58.4,64.2 61.5,64.2 62.3,63.4 62.3,51.4 | v34.5,88.9 34.5,66.6 v34.8,66.3 | v58.2,89 v58.2,67.1 | v81.5,88.9 81.5,68 v81.6,67.9 | v105.7,88.7 105.7,68.6 v105.6,68.5 | v129.7,88.6 v129.7,69.3 | v154.4,88.8 154.4,70.1 v154.3,70 | v178.9,88.9 178.9,85.7 176.8,83.6 v176.8,70.8 | v82.3,64.6 83,63.9 83,51.4 | v106.8,64.4 106.8,51.5 106.9,51.4 | v129.9,64.5 130.6,63.8 130.6,51.4 | v154.5,64.5 154.5,51.6 154.7,51.4 | v174.9,67.2 176.9,65.2 v176.9,51.4
  PWR-3/SIG 1.27: v59,29.5 59,48.1 62.3,51.4 83,51.4 106.9,51.4 130.6,51.4 154.7,51.4 v176.9,51.4 192.7,51.4 v192.8,51.3
  other vias: 35,13.5 33,13.5 39,13.5 41,13.5 43,13.5 45,13.5 59,27.5 59,25.5 59,23.5 59,21.5
  pour SIG_HS/SIG (isolate 0.406, no thermals): 23,14.5 23,15 52,15 56,19 57.5,20.5 57.5,29.5 58,30 61,30 61,20 60.5,19.5 53,12 23.5,12 23,12
  pour PWR-3/SIG (isolate 0.406, no thermals): 23,14.5 23,15 52,15 56,19 57.5,20.5 57.5,29.5 58,30 61,30 61,20 60.5,19.5 53,12 23.5,12 23,12
+5V_MEA1  (via drill 0.4)
  SIG_HS/SIG 0.508: L3.2 30.91,27.31 D9.A
  SIG_HS/SIG 0.61: J2.1 34.34,16.66 v34.3,16.7
  other vias: 32.8,16.7 34.3,18.2 35.8,18.2 12.8,33.7 12.8,35.2 12.8,36.7 12.8,32.2 12.8,30.7 23.8,20.7 25.8,20.7 27.8,20.7 29.8,20.7 28.8,21.7 26.8,21.7 24.8,21.7 23.8,22.7 25.8,22.7 27.8,22.7 29.8,22.7
  pour PWR-3/SIG (isolate 0.813, no thermals): 11.7,36.6 11.7,27.5 23,16.2 37.3,16.2 37.3,19.2 19.4,37.1 12.2,37.1
  pour SIG_HS/SIG (isolate 0.254, no thermals): 15.78,25.15 19.51,25.15 20.09,25.73 20.09,31.94 20.38,32.23 21.48,32.23 21.57,32.14 21.57,28.92 32.62,28.92 33.49,28.05 33.49,22.71 30.94,20.16 15.26,20.16 15.26,24.99
  pour SIG_HS/SIG (isolate 0.813, no thermals): 34.2,19.5 32.7,18 32.7,16 37.5,16 38,16.5 38,19 36,19 35.5,19.5
  pour SIG_HS/SIG (isolate 0.406, no thermals): 12.1,37.1 11.7,36.7 11.7,29.5 13.8,29.5 14.7,30.4 14.9,30.6 14.9,36.9 14.6,37.2 12.2,37.2
+5V_MEA2  (via drill 0.4)
  SIG_HS/SIG 0.508: L5.2 53.6,26.93 D13.A
  SIG_HS/SIG 0.61: J7.1 41.56,16.66 v41.7,16.8
  other vias: 41.7,18.3 40.2,18.3 41.7,19.8 35.2,29.8 35.2,31.3 35.2,32.8 35.2,34.3 36.7,34.3 36.7,32.8
  pour PWR-3/SIG (isolate 0.813, no thermals): 34.5,37.4 34.5,25.2 38.8,20.9 38.8,16.1 49.8,16.1 49.8,33.6 45.2,38.2 35.3,38.2
  pour SIG_HS/SIG (isolate 0.254, no thermals): 37.77,24.7 41.5,24.7 42.08,25.28 42.08,31.49 42.37,31.78 43.47,31.78 43.56,31.69 43.56,28.47 54.61,28.47 55.48,27.6 55.48,21.56 53.63,19.71 43,19.7 43,16.5 39,16.5 39,19.71 37.25,19.71 37.25,24.54
  pour SIG_HS/SIG (isolate 0.406, no thermals): 35,36.5 34.5,36 34.5,28.8 36.6,28.8 36.9,29.1 36.9,36.5
+12V  (via drill 0.2, 0.35)  (1 unrouted)
  SIG_HS/SIG 0.2: IC2.2 91.08,9.99 C4.1 | R162.2 105.8,8.25 C3.1
  SIG_HS/SIG 0.203: R150.1 112.14,20.2 v114.2,20.2
  SIG_HS/SIG 0.305: C4.1 91.08,7.54 90.31,6.77 C2.1 | IC1.2 107.81,9.8 C3.1 107.81,7.22 C1.1
  SIG_HS/SIG 0.61: R94.2 117.56,19.24 116.4,20.4 115.8,20.4 | IC3.10 129.13,36.13 128.3,35.3 v128.3,25
  SIG_HS/SIG 1.016: J10.1 207.1,49.01 | 207.1,49.01 208.05,49.01 J9.1 | K1.8 23.54,58.2 33.25,58.2 | 33.25,58.2 D1.C | K2.8 44.73,58.2 | D3.C 72.35,57.04 K3.8 68.36,63.22 | D4.C 96.34,56.87 K4.8 92.39,63.21 92.4,63.22 | D5.C 119.49,57.09 K5.8 116.21,63.11 116.1,63.22 | 144.22,60.77 K6.8 136.82,60.77 134.38,63.22 116.1,63.22 | D6.C 148.41,56.59 144.22,60.77 | K7.8 167.75,58.08 D7.C 189.99,58.08 K8.8 189.99,58.03 202.53,58.03 D8.C 205.56,57.73 206.9,56.4 206.9,49.21 207.1,49.01 | 116.1,63.22 92.4,63.22 | 92.4,63.22 68.36,63.22 | 68.36,63.22 65.22,63.22 59.52,57.52 D2.C 48.14,57.52 47.46,58.2 44.73,58.2 | 33.25,58.2 44.73,58.2 | 144.22,60.77 144.22,61.42 145.8,63 156.4,63 160.4,67 v166.3,67
  SIG_HS/SIG 1.27: J8.1 115.8,20.4 114.4,20.4 v114.2,20.2
  PWR-3/SIG 0.305: v88.6,7.2 88.6,6.6 v88.6,6
  PWR-3/SIG 0.61: v128.3,25 124.8,25 119.2,19.4 114.2,19.4
  PWR-3/SIG 1.016: v166.3,67 166.3,61.61 K7.8
  PWR-3/SIG 1.27: 88.6,6.6 94.3,6.6 95.5,5.4 104.5,5.4 v105,5.9 | v105,5.9 v105,7 | v88.6,7.2 v88.6,6 | v105,5.9 106.5,5.9 107.8,7.2 107.8,11.2 108.6,12 111,12 114.2,15.2 114.2,19.4 v114.2,20.2
  other vias: 114.2,17.6 114.2,19
  pour SIG_HS/SIG (isolate 0.254, rank 3, no thermals): 91.3,10.5 91.3,5.7 91,5.4 87.6,5.4 87.5,5.5 87.5,7.3 87.8,7.6 89.6,7.6 89.8,7.6 90.3,8.1 91,8.8 91,10.5
  pour SIG_HS/SIG (isolate 0.254, rank 3, no thermals): 108,10.4 108,5.6 107.7,5.3 104.3,5.3 104.2,5.4 104.2,7.2 104.5,7.5 105.4,7.5 105.4,10.4
  pour SIG_HS/SIG (isolate 0.254, rank 3, no thermals): 118.9,20.9 118.9,17 113.6,17 113.5,17.1 113.5,20.9
+12V_MEA  (via drill 0.2)
  SIG_HS/SIG 0.203: IC15.41 162.12,14.06 v162.12,13.9 | v120.89,18.07 120.89,19.19 | 120.89,19.19 120.91,19.21 | R94.1 120.88,19.24 | 120.88,19.24 R95.2 | 120.89,19.19 120.89,19.23 120.88,19.24
  SIG_BTM/AC_L 0.203: v162.12,13.9 158.02,9.8 158.02,9.58 157.44,9.01 156.99,9.01 156.62,8.64 156.62,8.4 155.55,7.33 154.02,7.33 151.27,10.08 145.75,10.08 145.38,9.71 145.38,7.48 145.23,7.33 136.27,7.33 134.03,5.09 128.23,5.09 120.89,12.43 v120.89,18.07
AC_L  (via drill 0.4)
  SIG_HS/SIG 0.61: v31.5,53.5 v33,53.5 | v33,53.5 v34.5,53.5 | v33,53.5 33,51.63 R62.1 | v52.5,53.5 v54,53.5 | v54,53.5 v55.5,53.5 | v54,53.5 54,51.63 R106.1
  SIG_BTM/AC_L 2.54: AC/DC1.AC_L 74.36,24.66 76.13,26.43 76.13,44.23 | 76.13,44.23 | 76.13,44.23 76.13,44.81 76.13,51.67 75.3,52.5 65.5,52.5 | AC/DC2.AC/L 65.74,52.26 65.5,52.5 | 65.5,52.5 16.86,52.5 AC_L.B3,0
  other vias: 20,78 22,78 24,78 26,78 28,78 30,78 30,74 28,74 26,74 24,74 22,74 20,74 29,76 27,76 25,76 23,76 21,76 25,80 24,82 26,82 43.5,78 45.5,78 47.5,78 49.5,78 51.5,78 53.5,78 53.5,74 51.5,74 49.5,74 47.5,74 45.5,74 43.5,74 52.5,76 50.5,76 48.5,76 46.5,76 44.5,76 48.5,80 47.5,82 49.5,82 67,78 69,78 71,78 73,78 75,78 77,78 77,74 75,74 73,74 71,74 69,74 67,74 76,76 74,76 72,76 70,76 68,76 72,80 71,82 73,82 91,77.5 93,77.5 95,77.5 97,77.5 99,77.5 101,77.5 101,73.5 99,73.5 97,73.5 95,73.5 93,73.5 91,73.5 100,75.5 98,75.5 96,75.5 94,75.5 92,75.5 96,79.5 95,81.5 97,81.5 115,78 117,78 119,78 121,78 123,78 125,78 125,74 123,74 121,74 119,74 117,74 115,74 124,76 122,76 120,76 118,76 116,76 120,80 119,82 121,82 139.5,78 141.5,78 143.5,78 145.5,78 147.5,78 149.5,78 149.5,74 147.5,74 145.5,74 143.5,74 141.5,74 139.5,74 148.5,76 146.5,76 144.5,76 142.5,76 140.5,76 144.5,80 143.5,82 145.5,82 164,78 166,78 168,78 170,78 172,78 174,78 174,74 172,74 170,74 168,74 166,74 164,74 173,76 171,76 169,76 167,76 165,76 169,80 168,82 170,82 189,78 191,78 193,78 195,78 197,78 199,78 199,74 197,74 195,74 193,74 191,74 189,74 198,76 196,76 194,76 192,76 190,76 194,80 193,82 195,82 20,56 20,54 20,52 24,52 24,54 24,56 28,56 28,54 28,52 22,55 22,53 26,55 26,53 30,55 30,53 12,60 14,60 16,60 13,62 15,62 12,64 14,64 16,64 17,62
  pour SIG_BTM/AC_L (isolate 0.813, no thermals): 11,50 11,82.5 200.5,82.5 200.5,50 195,50 195,53 158,53 158,50
  pour GND-2/AC_L (isolate 0.813, no thermals): 11,50 11,82.5 200.5,82.5 200.5,50 195,50 195,53 158,53 158,50
ADC_V_USB
  SIG_HS/SIG 0.203: R127.1 168.15,14.05 166.84,12.74 161.74,12.74 IC15.38
  SIG_HS/SIG 0.254: R126.2 169.73,14.79 R127.1
AGND  (via drill 0.2, 0.35, 0.4)  (8 unrouted)
  SIG_HS/SIG 0.2: IC16.5 184.34,83.56 | v84.5,100.9 84.29,100.69 R83.2 83.63,100.9 v83,100.9 | v157.21,101.05 157.21,100.97 R99.2 156.2,100.56 v155.71,101.05 | IC11.5 134.95,83.62 | IC8.5 39.7,83.84 39.4,83.84
  SIG_HS/SIG 0.203: v132,100.9 132,100.8 R75.2 131.84,100.6
  SIG_HS/SIG 0.254: C108.2 167.1,55.5 v167.4,55.8 | C107.2 169.7,55.3 v169.9,55.5 | C106.2 172.72,53.88 v173.1,53.5 | C109.2 164.6,54.6 v164.7,54.7 | C110.2 187.62,53.9 v188.4,53.9 | C111.2 185.2,55.8 v185.3,55.9 | C112.2 182.5,55.4 v182.8,55.7 | C113.2 180,55.8 v180.2,56 | R43.2 108,100.54 v108,100.9 | R115.2 182.21,100.41 v182.21,100.75
  SIG_HS/SIG 0.406: C30.2 36.58,91.1 v34.7,91.1 | R49.1 36.68,99.91 R51.2 | R65.1 60.38,100.06 R67.2 | R81.1 84.1,100.44 R83.2 | R41.1 107.98,100.16 R43.2 | R73.1 132.2,100.05 132.14,100.11 132.21,100.18 132.21,100.23 131.84,100.6 | R97.1 157.29,97.36 157.29,100.07 R99.2 | R40.2 12.95,79.79 C26.2 12.95,83.75 v13.4,84.2 13.78,83.82 IC6.5 | C25.2 16.95,91.03 v16.95,89.45 | C24.2 13.33,91.15 v11.17,91.15 | C31.2 40.24,91.02 v40.24,89.74 | C37.2 64.13,89.79 v64.07,89.73 | C36.2 60.15,91.07 v58.8,91.07 | R72.2 C38.2 60.42,83.82 60.69,84.09 60.99,84.09 | 60.99,84.09 v60.71,83.81 | IC10.5 60.99,84.09 | C32.2 36.9,82.1 R56.2 36.88,83.62 v37,83.74 37.1,83.84 39.4,83.84 | R88.2 C44.2 84.32,83.99 84.44,84.11 84.74,84.11 | 84.74,84.11 v84.36,83.73 | IC12.5 84.74,84.11 | C43.2 88.43,90.05 v88.16,89.78 | C42.2 83.94,91.06 v82.1,91.06 | C28.2 112.13,91.11 v112.13,89.58 | C27.2 107.54,90.78 v106.4,90.78 | R48.2 C29.2 108.32,83.26 108.15,83.43 | v108.38,83.46 108.18,83.46 108.15,83.43 | 110.8,83.43 108.15,83.43 | R80.2 C41.2 132.62,83.15 132.7,83.23 v132.7,83.43 132.89,83.62 134.95,83.62 | C40.2 136.38,91.25 v136.38,89.91 | C39.2 131.91,91.06 v130.15,91.06 | C48.2 157.21,90.81 v156.08,89.68 | C49.2 161.14,91.13 v161.14,89.66 | IC14.5 157.63,83.84 v157.3,83.51 157.2,83.41 C50.2 R104.2 | R120.2 C56.2 181.9,83.26 v181.78,83.38 181.96,83.56 184.34,83.56 | C54.2 181.4,90.08 v180.64,89.32 | C55.2 186.13,89.43 v186.09,89.39
  SIG_HS/SIG 0.508: R35.2 13.38,99.78 R33.1
  SIG_HS/SIG 0.813: C23.2 17.21,28.24 13.02,28.24 13.02,20.08 14.41,18.69 31.77,18.69 35.28,22.2 35.28,27.43 35.38,27.53 C53.2 39.88,30.6 39.55,30.93 | 39.99,30.93 39.55,30.93 | 39.55,30.93 R108.2
  SIG_HS/SIG 1.27: C23.2 17.28,30.76 18.33,31.81 17.06,31.81 | 17.06,31.81 R96.2 | 17.06,31.81 16.88,31.99 D11.A 16.88,37.04 16.19,37.73 16.19,45.51 16.7,46.02 C35.2 | 39.99,30.93 R108.2 38.58,31.08 D14.A 38.58,37.45 37.48,38.55 37.48,45.84 38.06,46.42 C47.2 | 39.99,30.93 C57.1 | C53.2 39.88,30.82 39.99,30.93
  SIG_HS/SIG 2.54: AC/DC1.AC_N 67.02,35.41 65.74,34.13 AC/DC2.AC/N 65.74,17.74 57,9 16.6,9 4.51,21.09 AC_N.B3,0
  other vias: 132,102.4 157.21,102.55 108,102.4 84.5,102.4 60,102.4 36.5,102.4 13,102 157.21,99.55 157.21,98.05 155.71,98.05 155.71,99.55 155.71,102.55 154.21,102.55 154.21,101.05 154.21,99.55 154.21,98.05 130.5,102.4 129,102.4 129,100.9 129,99.4 129,97.9 130.5,97.9 130.5,99.4 130.5,100.9 132,99.4 132,97.9 106.5,102.4 105,102.4 105,100.9 105,99.4 105,97.9 106.5,97.9 108,97.9 106.5,99.4 108,99.4 106.5,100.9 84.5,99.4 84.5,97.9 83,97.9 81.5,97.9 81.5,99.4 81.5,100.9 81.5,102.4 83,102.4 83,99.4 58.5,102.4 57,102.4 57,100.9 57,99.4 57,97.9 58.5,97.9 60,97.9 58.5,99.4 60,99.4 58.5,100.9 60,100.9 35,102.4 33.5,102.4 33.5,100.9 33.5,99.4 33.5,97.9 35,97.9 35,99.4 35,100.9 36.5,100.9 36.5,99.4 36.5,97.9 11.5,102 10,102 10,100.5 10,99 10,97.5 11.5,97.5 11.5,99 11.5,100.5 13,100.5 13,99 13,97.5 182.21,102.25 180.71,102.25 179.21,102.25 179.21,100.75 179.21,99.25 179.21,97.75 180.71,97.75 180.71,99.25 180.71,100.75 182.21,99.25 182.21,97.75 177.71,102.25 176.21,102.25 176.21,100.75 176.21,99.25 176.21,97.75 177.71,97.75 177.71,99.25 177.71,100.75 152.71,102.55 151.21,102.55 151.21,101.05 151.21,99.55 151.21,98.05 152.71,98.05 152.71,99.55 152.71,101.05 127.61,102.35 126.11,102.35 126.11,100.85 126.11,99.35 126.11,97.85 127.61,97.85 127.61,99.35 127.61,100.85 79.91,102.35 78.41,102.35 78.41,100.85 78.41,99.35 78.41,97.85 79.91,97.85 79.91,99.35 79.91,100.85 55.51,102.35 54.01,102.35 54.01,100.85 54.01,99.35 54.01,97.85 55.51,97.85 55.51,99.35 55.51,100.85 32.11,102.35 30.61,102.35 30.61,100.85 30.61,99.35 30.61,97.85 32.11,97.85 32.11,99.35 32.11,100.85 9.95,105.01 9.95,103.51 11.45,103.51 12.95,103.51 14.45,103.51 14.45,105.01 12.95,105.01 11.45,105.01 83.5,75 83.5,73 83.5,71 80,75 80,73 80,71 60,75 60,73 60,71 56.5,71 56.5,73 56.5,75 104,71 104,73 104,75 108,75 108,73 108,71 112,75 112,73 112,71 87.5,75 87.5,73 87.5,71 63.5,75 63.5,73 63.5,71 36.5,75 36.5,73 36.5,71 32.5,71 32.5,73 32.5,75 40.5,75 40.5,73 40.5,71 10,73.5 10,71.5 10,69.5 8,70.5 8,72.5 6.5,73.5 6.5,71.5 6.5,69.5 5,72.5 5,70.5 3.5,69.5 3.5,71.5 3.5,73.5 128,75 128,73 128,71 132,71 132,73 132,75 136,75 136,73 152.5,75.5 152.5,73.5 152.5,71.5 156.5,75.5 156.5,73.5 156.5,71.5 161,75.5 161,73.5 161,71.5 180.5,74.5 180.5,72.5 180.5,70.5 185,74.5 185,72.5 185,70.5 203,74.5 203,72.5 203,70.5 206,70.5 206,72.5 206,74.5 13.1,28.1 13.1,26.3 13.1,23.9 13.1,21.9 24.7,18.7 27.3,18.7 29.7,18.7 35.3,26.1 35.3,23.7 38.5,33.1 37.9,38.1 37.5,44.1 37.5,41.3 16.1,44.1 16.1,40.9 37.3,27.5 103.61,102.35 102.11,102.35 102.11,100.85 102.11,99.35 102.11,97.85 103.61,97.85 103.61,99.35 103.61,100.85
  pour SIG/AGND (isolate 0.813, rank 5, no thermals): -1.2,11.57 -1.2,109.3 211.3,109.3 211.3,83.8 211,83.5 200.5,83.5 200.5,96 187.5,96 187.5,83.5 175.5,83.5 175.5,96 162.5,96 162.5,83.5 151,83.5 151,96 138,96 138,83.5 126.5,83.5 126.5,96 113.5,96 113.5,83.5 102.5,83.5 102.5,96 89.5,96 89.5,83.5 78.5,83.5 78.5,96 65.5,96 65.5,83.5 55,83.5 55,96 42,96 42,83.5 31.5,83.5 31.5,96 18.5,96 18.5,83.81 9.36,83.81 10,52 57,52 57,40 69,40 69,7 9.87,7 arc90 5.3,11.57